# EAGLE schematic usb-fpga-1.20 (EAGLE 4.15)

## Sheet 1 of 8
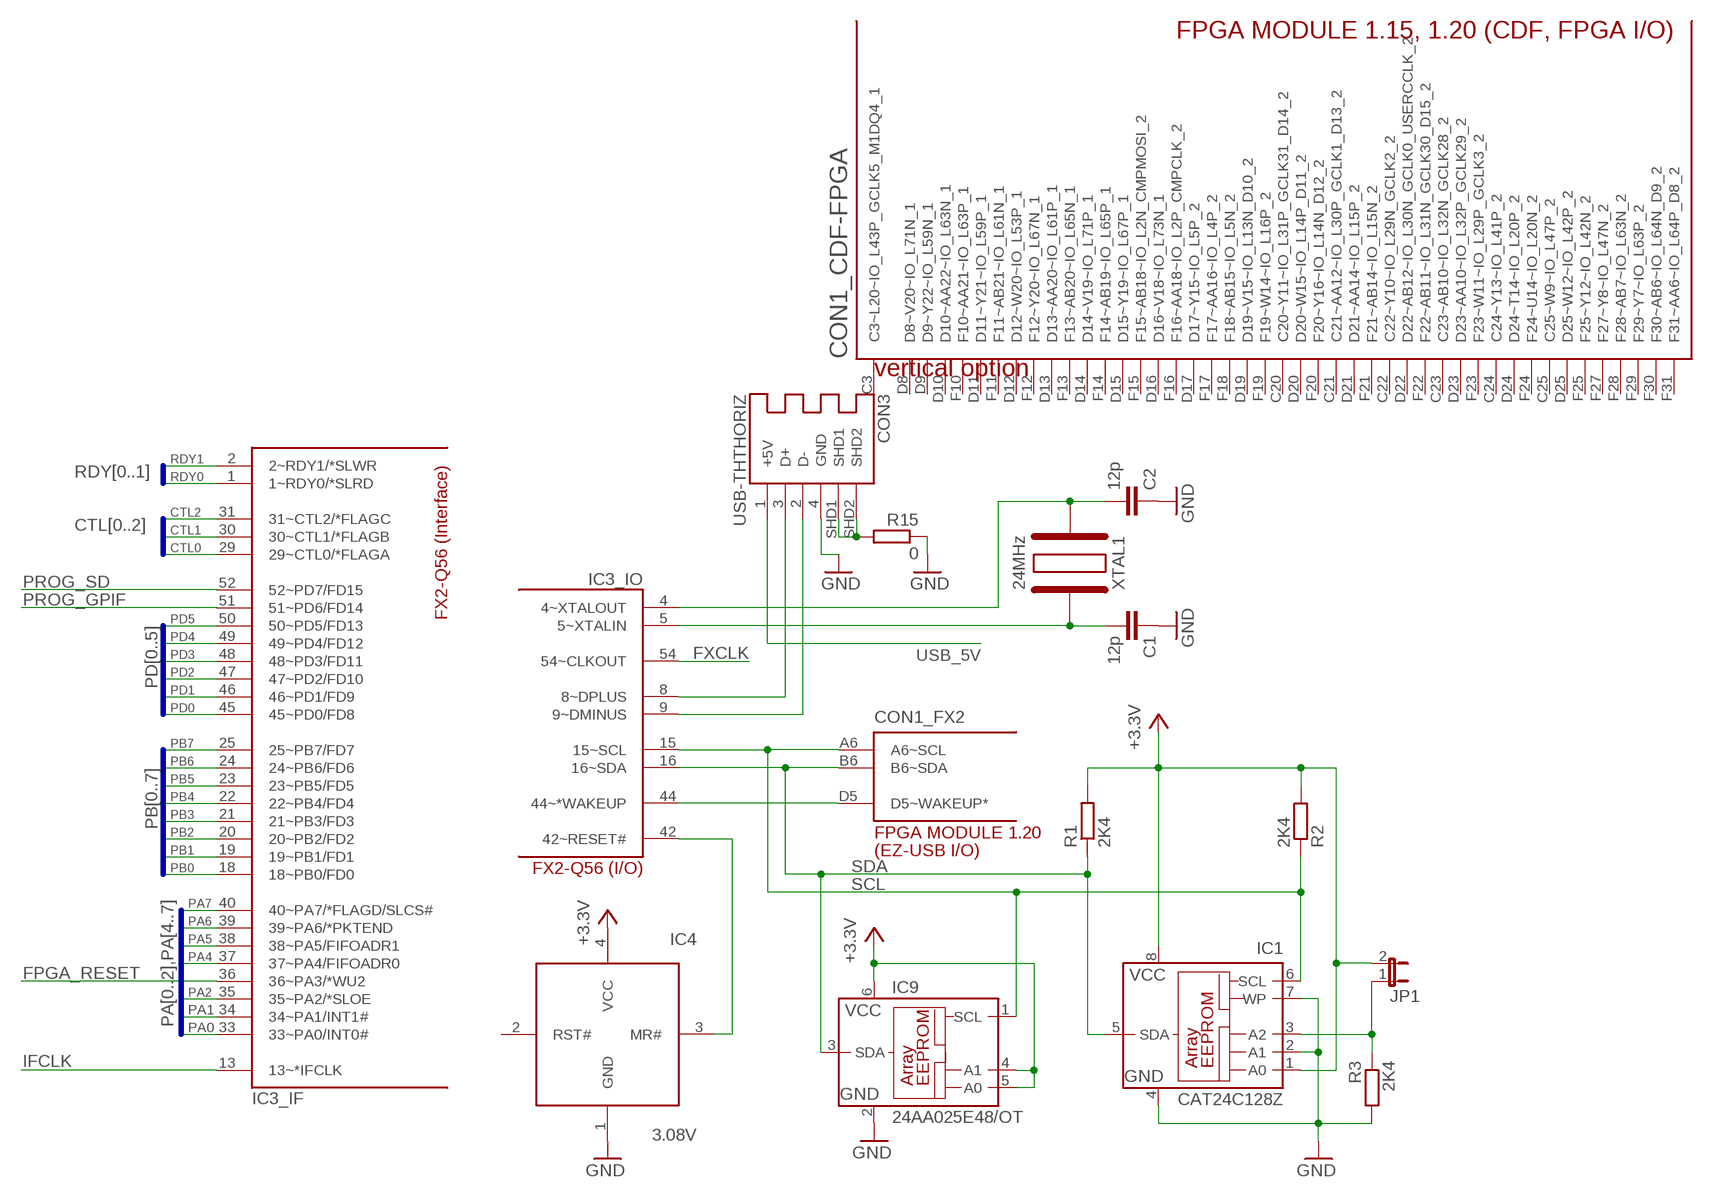
[diagram p0: schematic, sheet 1]

### Parts
C1  12p  C-EUC0805K  [C0805K]
C2  12p  C-EUC0805K  [C0805K]
CON1  1GBE-USB-FPGA1.20  [USB-FPGA1.15]
CON3  USB-THTHORIZ  [USB-HORIZ]
IC1  CAT24C128Z  [MSOP8]
IC3  FX2-Q56  [QFN-56]
IC4  3.08V  STM811  [SOT143]
IC9  24AA025E48/OT  [SOT23-6]
JP1  JP1E2MM  [JP1R2MM]
R1  2K4  R-EU_R0805K  [R0805K]
R2  2K4  R-EU_R0805K  [R0805K]
R3  2K4  R-EU_R0805K  [R0805K]
R15  0  R-EU_R0805K  [R0805K]
XTAL1  24MHz  CRYSTALHU29  [CRYSTAL-HU29]

### Nets
+3.3V [xpwr]: IC1.1(A0) IC1.8(VCC) IC4.4(VCC) IC9.4(A1) IC9.5(A0) IC9.6(VCC) JP1.2 R1.2 R2.2 ; also sheet 2,6,8
CTL0: IC3.29(_IF:29~CTL0/*FLAGA) ; also sheet 3
CTL1: IC3.30(_IF:30~CTL1/*FLAGB) ; also sheet 3
CTL2: IC3.31(_IF:31~CTL2/*FLAGC) ; also sheet 2,3
FPGA_RESET: IC3.36(_IF:36~PA3/*WU2) ; also sheet 2
FXCLK: IC3.54(_IO:54~CLKOUT) ; also sheet 2,3
GND [xpwr]: C1.1 C2.1 CON3.4(GND) IC1.2(A1) IC1.4(GND) IC1.7(WP) IC4.1(GND) IC9.2(GND) R3.2 R15.1 ; also sheet 2,5,6,8
IFCLK: IC3.13(_IF:13~*IFCLK) ; also sheet 2,3
N$3: CON1.D5(_FX2:D5~WAKEUP*) IC3.44(_IO:44~*WAKEUP)
N$5: IC3.42(_IO:42~RESET#) IC4.3(MR#)
N$6 [xpwr]: CON3.SHD1 CON3.SHD2 R15.2
N$103: IC1.3(A2) JP1.1 R3.1
PA0: IC3.33(_IF:33~PA0/INT0#) ; also sheet 3,6
PA1: IC3.34(_IF:34~PA1/INT1#) ; also sheet 3,6
PA2: IC3.35(_IF:35~PA2/*SLOE) ; also sheet 3
PA4: IC3.37(_IF:37~PA4/FIFOADR0) ; also sheet 2,3
PA5: IC3.38(_IF:38~PA5/FIFOADR1) ; also sheet 3
PA6: IC3.39(_IF:39~PA6/*PKTEND) ; also sheet 3
PA7: IC3.40(_IF:40~PA7/*FLAGD/SLCS#) ; also sheet 3
PB0: IC3.18(_IF:18~PB0/FD0) ; also sheet 2,3
PB1: IC3.19(_IF:19~PB1/FD1) ; also sheet 3
PB2: IC3.20(_IF:20~PB2/FD2) ; also sheet 3
PB3: IC3.21(_IF:21~PB3/FD3) ; also sheet 3
PB4: IC3.22(_IF:22~PB4/FD4) ; also sheet 3
PB5: IC3.23(_IF:23~PB5/FD5) ; also sheet 3
PB6: IC3.24(_IF:24~PB6/FD6) ; also sheet 3
PB7: IC3.25(_IF:25~PB7/FD7) ; also sheet 3
PD0: IC3.45(_IF:45~PD0/FD8) ; also sheet 2,3
PD1: IC3.46(_IF:46~PD1/FD9) ; also sheet 3
PD2: IC3.47(_IF:47~PD2/FD10) ; also sheet 2,3
PD3: IC3.48(_IF:48~PD3/FD11) ; also sheet 3
PD4: IC3.49(_IF:49~PD4/FD12) ; also sheet 3
PD5: IC3.50(_IF:50~PD5/FD13) ; also sheet 3
PROG_GPIF: IC3.51(_IF:51~PD6/FD14) ; also sheet 2
PROG_SD: IC3.52(_IF:52~PD7/FD15) ; also sheet 2
RDY0: IC3.1(_IF:1~RDY0/*SLRD) ; also sheet 3
RDY1: IC3.2(_IF:2~RDY1/*SLWR) ; also sheet 3
SCL: CON1.A6(_FX2:A6~SCL) IC1.6(SCL) IC3.15(_IO:15~SCL) IC9.1(SCL) R2.1 ; also sheet 3
SDA: CON1.B6(_FX2:B6~SDA) IC1.5(SDA) IC3.16(_IO:16~SDA) IC9.3(SDA) R1.1 ; also sheet 3
USB_5V [pwr]: CON3.1(+5V) ; also sheet 8
USBD+: CON3.3(D+) IC3.8(_IO:8~DPLUS)
USBD-: CON3.2(D-) IC3.9(_IO:9~DMINUS)
XTAL1A: C2.2 IC3.4(_IO:4~XTALOUT) XTAL1.P$2
XTAL1B: C1.2 IC3.5(_IO:5~XTALIN) XTAL1.P$1
Unconnected: CON1.C7(_COMPAT:C7~VCCO_TOP) CON1.C27(_COMPAT:C27~VCCO_TOP) CON1.C30(_COMPAT:C30~M0) CON1.C31(_COMPAT:C31~M1) CON1.D7(_COMPAT:D7~VCCO_TOP) CON1.D27(_COMPAT:D27~VCCO_TOP) IC4.2(RST#)

### Buses
PA[0..2],PA[4..7]
PD[0..5]
PB[0..7]
CTL[0..2]
RDY[0..1]

### Notes on the sheet
- vertical option

## Sheet 2 of 8
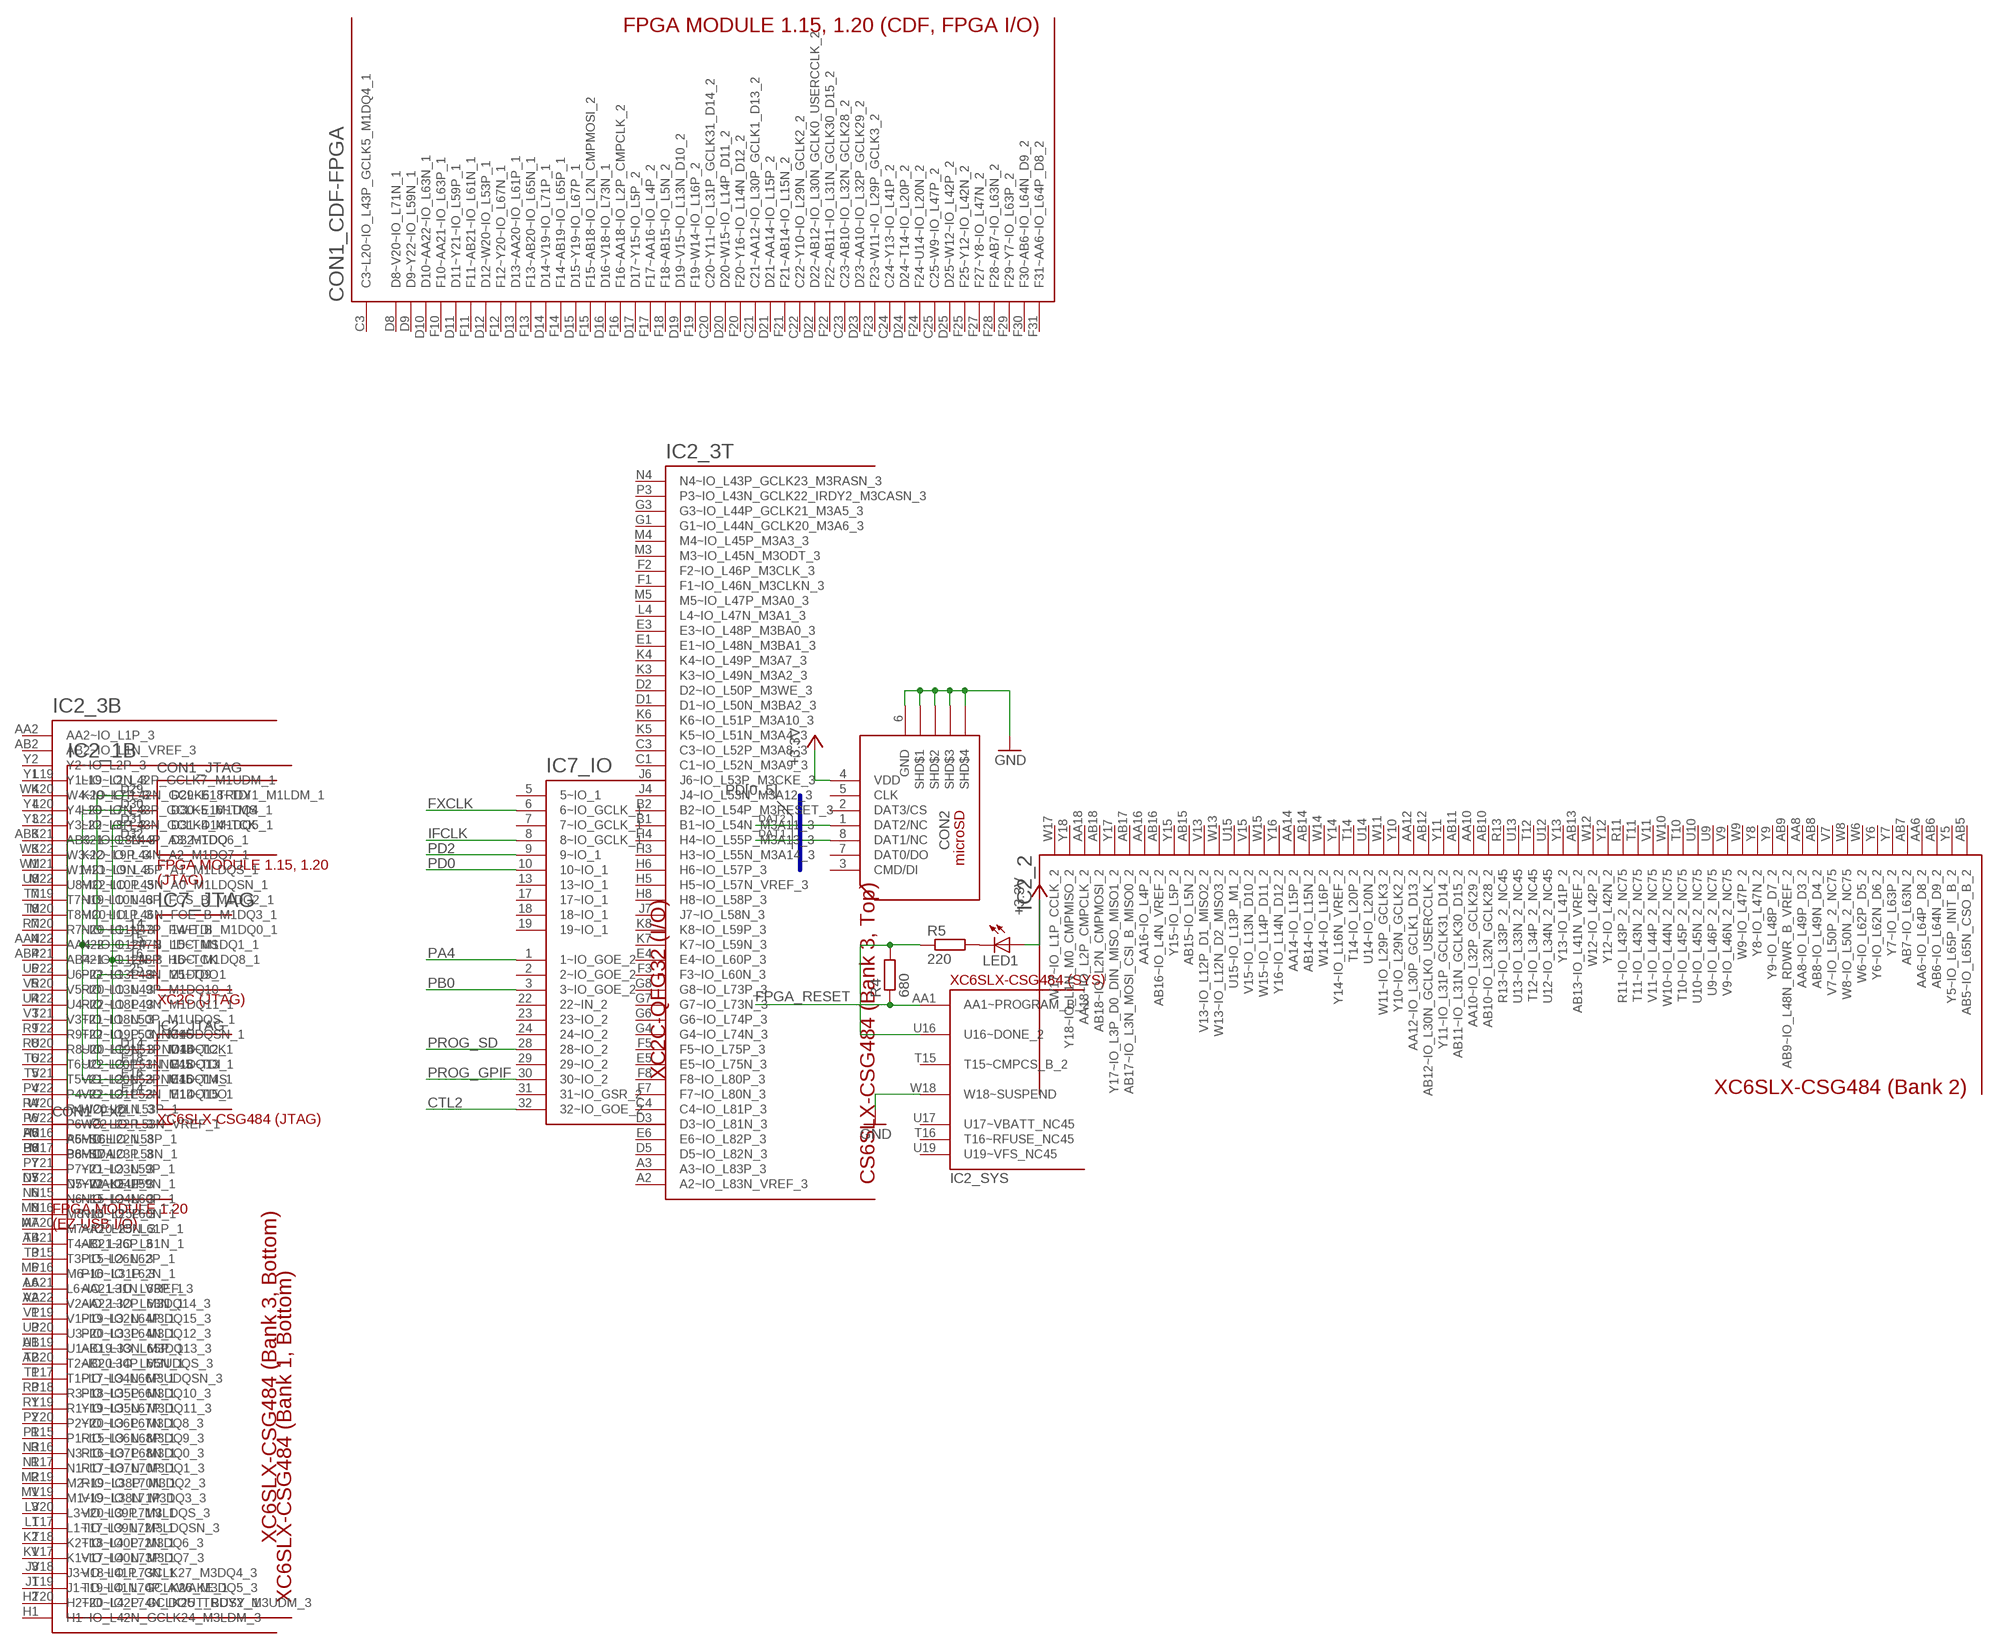
[diagram p1: schematic, sheet 2]

### Parts
CON2  MICROSDMC  [MICROSD-MULTICOMP]
IC2  XC6SLX-CSG484CSG484  [CSG484]
IC7  XC2C-QFG32QFG32  [QFG32]
LED1  LED1206-A_MARK  [LED1206-A_MARK]
R4  680  R-EU_R0805K  [R0805K]
R5  220  R-EU_R0805K  [R0805K]

### Nets
+3.3V [xpwr]: CON2.4(VDD) LED1.A ; also sheet 1,6,8
CTL2: IC7.32(_IO:32~IO_GOE_2) ; also sheet 1,3
DAT1: CON2.8(DAT1/NC) ; also sheet 3
DAT2: CON2.1(DAT2/NC) ; also sheet 3
FPGA_RESET: IC2.AA1(_SYS:AA1~PROGRAM_B_2) R4.1 ; also sheet 1
FXCLK: IC7.6(_IO:6~IO_GCLK_1) ; also sheet 1,3
GND [xpwr]: CON2.6(GND) CON2.CD1(SHD$1) CON2.CD2(SHD$2) CON2.SGD2(SHD$3) CON2.SHD1(SHD$4) IC2.W18(_SYS:W18~SUSPEND) ; also sheet 1,5,6,8
IFCLK: IC7.8(_IO:8~IO_GCLK_1) ; also sheet 1,3
N$1: IC2.U16(_SYS:U16~DONE_2) R4.2 R5.1
N$4: LED1.C R5.2
PA4: IC7.1(_IO:1~IO_GOE_2) ; also sheet 1,3
PB0: IC7.3(_IO:3~IO_GOE_2) ; also sheet 1,3
PD0: IC7.10(_IO:10~IO_1) ; also sheet 1,3
PD2: IC7.9(_IO:9~IO_1) ; also sheet 1,3
PROG_GPIF: IC7.30(_IO:30~IO_2) ; also sheet 1
PROG_SD: IC7.28(_IO:28~IO_2) ; also sheet 1
TCK: CON1.D31(_JTAG:D31~D14~TCK) IC2.D14(_JTAG:D14~TCK) IC7.16(_JTAG:16~TCK)
TDI: CON1.D29(_JTAG:D29~E18~TDI) IC7.14(_JTAG:14~TDI)
TDIO: IC2.E18(_JTAG:E18~TDI) IC7.25(_JTAG:25~TDO)
TDO: CON1.D32(_JTAG:D32~TDO) IC2.E14(_JTAG:E14~TDO)
TMS: CON1.D30(_JTAG:D30~E16~TMS) IC2.E16(_JTAG:E16~TMS) IC7.15(_JTAG:15~TMS)
Unconnected: CON2.2(DAT3/CS) CON2.3(CMD/DI) CON2.5(CLK) CON2.7(DAT0/DO) IC2.T15(_SYS:T15~CMPCS_B_2) IC2.T16(_SYS:T16~RFUSE_NC45) IC2.U17(_SYS:U17~VBATT_NC45) IC2.U19(_SYS:U19~VFS_NC45) IC7.2(_IO:2~IO_GOE_2) IC7.5(_IO:5~IO_1) IC7.7(_IO:7~IO_GCLK_1) IC7.13(_IO:13~IO_1) IC7.17(_IO:17~IO_1) IC7.18(_IO:18~IO_1) IC7.19(_IO:19~IO_1) IC7.22(_IO:22~IN_2) IC7.23(_IO:23~IO_2) IC7.24(_IO:24~IO_2) IC7.29(_IO:29~IO_2) IC7.31(_IO:31~IO_GSR_2)

### Buses
PD[0..5]

## Sheet 3 of 8
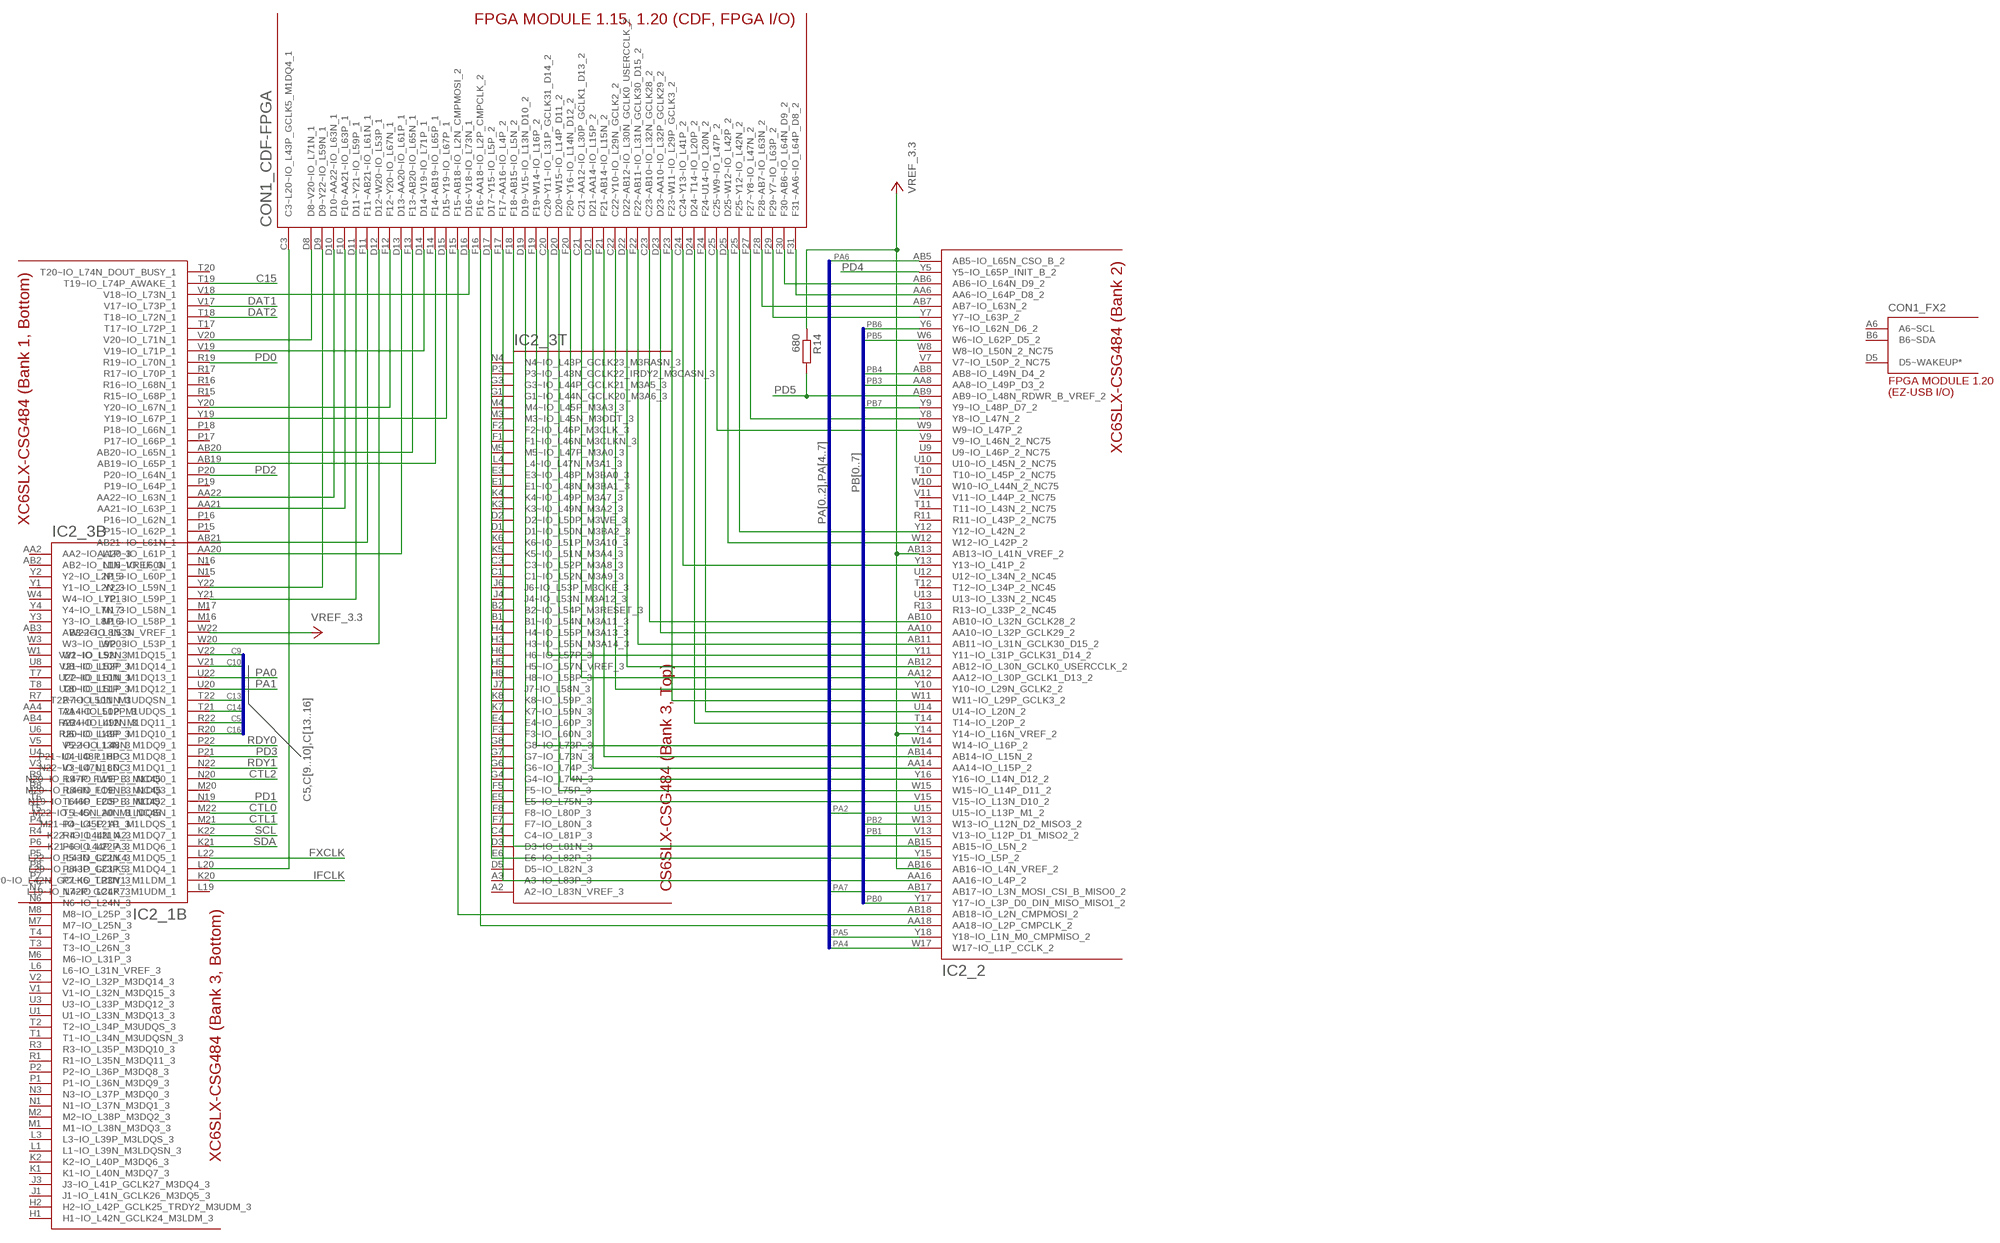
[diagram p2: schematic, sheet 3]

### Parts
R14  680  R-EU_R0805K  [R0805K]

### Nets
C3: CON1.C3(_CDF-FPGA:C3~L20~IO_L43P_GCLK5_M1DQ4_1) IC2.L20(_1B:L20~IO_L43P_GCLK5_M1DQ4_1)
C5: IC2.R22(_1B:R22~IO_L49N_M1DQ11_1) ; also sheet 6
C9: IC2.V22(_1B:V22~IO_L52N_M1DQ15_1) ; also sheet 6
C10: IC2.V21(_1B:V21~IO_L52P_M1DQ14_1) ; also sheet 6
C13: IC2.T22(_1B:T22~IO_L50N_M1UDQSN_1) ; also sheet 6
C14: IC2.T21(_1B:T21~IO_L50P_M1UDQS_1) ; also sheet 6
C15: IC2.T19(_1B:T19~IO_L74P_AWAKE_1) ; also sheet 6
C16: IC2.R20(_1B:R20~IO_L49P_M1DQ10_1) ; also sheet 6
C20: CON1.C20(_CDF-FPGA:C20~Y11~IO_L31P_GCLK31_D14_2) IC2.Y11(_2:Y11~IO_L31P_GCLK31_D14_2)
C21: CON1.C21(_CDF-FPGA:C21~AA12~IO_L30P_GCLK1_D13_2) IC2.AA12(_2:AA12~IO_L30P_GCLK1_D13_2)
C22: CON1.C22(_CDF-FPGA:C22~Y10~IO_L29N_GCLK2_2) IC2.Y10(_2:Y10~IO_L29N_GCLK2_2)
C23: CON1.C23(_CDF-FPGA:C23~AB10~IO_L32N_GCLK28_2) IC2.AB10(_2:AB10~IO_L32N_GCLK28_2)
C24: CON1.C24(_CDF-FPGA:C24~Y13~IO_L41P_2) IC2.Y13(_2:Y13~IO_L41P_2)
C25: CON1.C25(_CDF-FPGA:C25~W9~IO_L47P_2) IC2.W9(_2:W9~IO_L47P_2)
CTL0: IC2.M22(_1B:M22~IO_L45N_A0_M1LDQSN_1) ; also sheet 1
CTL1: IC2.M21(_1B:M21~IO_L45P_A1_M1LDQS_1) ; also sheet 1
CTL2: IC2.N20(_1B:N20~IO_L47P_FWE_B_M1DQ0_1) ; also sheet 1,2
D8: CON1.D8(_CDF-FPGA:D8~V20~IO_L71N_1) IC2.V20(_1B:V20~IO_L71N_1)
D9: CON1.D9(_CDF-FPGA:D9~Y22~IO_L59N_1) IC2.Y22(_1B:Y22~IO_L59N_1)
D10: CON1.D10(_CDF-FPGA:D10~AA22~IO_L63N_1) IC2.AA22(_1B:AA22~IO_L63N_1)
D11: CON1.D11(_CDF-FPGA:D11~Y21~IO_L59P_1) IC2.Y21(_1B:Y21~IO_L59P_1)
D12: CON1.D12(_CDF-FPGA:D12~W20~IO_L53P_1) IC2.W20(_1B:W20~IO_L53P_1)
D13: CON1.D13(_CDF-FPGA:D13~AA20~IO_L61P_1) IC2.AA20(_1B:AA20~IO_L61P_1)
D14: CON1.D14(_CDF-FPGA:D14~V19~IO_L71P_1) IC2.V19(_1B:V19~IO_L71P_1)
D15: CON1.D15(_CDF-FPGA:D15~Y19~IO_L67P_1) IC2.Y19(_1B:Y19~IO_L67P_1)
D16: CON1.D16(_CDF-FPGA:D16~V18~IO_L73N_1) IC2.V18(_1B:V18~IO_L73N_1)
D17: CON1.D17(_CDF-FPGA:D17~Y15~IO_L5P_2) IC2.Y15(_2:Y15~IO_L5P_2)
D19: CON1.D19(_CDF-FPGA:D19~V15~IO_L13N_D10_2) IC2.V15(_2:V15~IO_L13N_D10_2)
D20: CON1.D20(_CDF-FPGA:D20~W15~IO_L14P_D11_2) IC2.W15(_2:W15~IO_L14P_D11_2)
D21: CON1.D21(_CDF-FPGA:D21~AA14~IO_L15P_2) IC2.AA14(_2:AA14~IO_L15P_2)
D22: CON1.D22(_CDF-FPGA:D22~AB12~IO_L30N_GCLK0_USERCCLK_2) IC2.AB12(_2:AB12~IO_L30N_GCLK0_USERCCLK_2)
D23: CON1.D23(_CDF-FPGA:D23~AA10~IO_L32P_GCLK29_2) IC2.AA10(_2:AA10~IO_L32P_GCLK29_2)
D24: CON1.D24(_CDF-FPGA:D24~T14~IO_L20P_2) IC2.T14(_2:T14~IO_L20P_2)
D25: CON1.D25(_CDF-FPGA:D25~W12~IO_L42P_2) IC2.W12(_2:W12~IO_L42P_2)
DAT1: IC2.V17(_1B:V17~IO_L73P_1) ; also sheet 2
DAT2: IC2.T18(_1B:T18~IO_L72N_1) ; also sheet 2
F10: CON1.F10(_CDF-FPGA:F10~AA21~IO_L63P_1) IC2.AA21(_1B:AA21~IO_L63P_1)
F11: CON1.F11(_CDF-FPGA:F11~AB21~IO_L61N_1) IC2.AB21(_1B:AB21~IO_L61N_1)
F12: CON1.F12(_CDF-FPGA:F12~Y20~IO_L67N_1) IC2.Y20(_1B:Y20~IO_L67N_1)
F13: CON1.F13(_CDF-FPGA:F13~AB20~IO_L65N_1) IC2.AB20(_1B:AB20~IO_L65N_1)
F14: CON1.F14(_CDF-FPGA:F14~AB19~IO_L65P_1) IC2.AB19(_1B:AB19~IO_L65P_1)
F15: CON1.F15(_CDF-FPGA:F15~AB18~IO_L2N_CMPMOSI_2) IC2.AB18(_2:AB18~IO_L2N_CMPMOSI_2)
F16: CON1.F16(_CDF-FPGA:F16~AA18~IO_L2P_CMPCLK_2) IC2.AA18(_2:AA18~IO_L2P_CMPCLK_2)
F17: CON1.F17(_CDF-FPGA:F17~AA16~IO_L4P_2) IC2.AA16(_2:AA16~IO_L4P_2)
F18: CON1.F18(_CDF-FPGA:F18~AB15~IO_L5N_2) IC2.AB15(_2:AB15~IO_L5N_2)
F19: CON1.F19(_CDF-FPGA:F19~W14~IO_L16P_2) IC2.W14(_2:W14~IO_L16P_2)
F20: CON1.F20(_CDF-FPGA:F20~Y16~IO_L14N_D12_2) IC2.Y16(_2:Y16~IO_L14N_D12_2)
F21: CON1.F21(_CDF-FPGA:F21~AB14~IO_L15N_2) IC2.AB14(_2:AB14~IO_L15N_2)
F22: CON1.F22(_CDF-FPGA:F22~AB11~IO_L31N_GCLK30_D15_2) IC2.AB11(_2:AB11~IO_L31N_GCLK30_D15_2)
F23: CON1.F23(_CDF-FPGA:F23~W11~IO_L29P_GCLK3_2) IC2.W11(_2:W11~IO_L29P_GCLK3_2)
F24: CON1.F24(_CDF-FPGA:F24~U14~IO_L20N_2) IC2.U14(_2:U14~IO_L20N_2)
F25: CON1.F25(_CDF-FPGA:F25~Y12~IO_L42N_2) IC2.Y12(_2:Y12~IO_L42N_2)
F27: CON1.F27(_CDF-FPGA:F27~Y8~IO_L47N_2) IC2.Y8(_2:Y8~IO_L47N_2)
F28: CON1.F28(_CDF-FPGA:F28~AB7~IO_L63N_2) IC2.AB7(_2:AB7~IO_L63N_2)
F29: CON1.F29(_CDF-FPGA:F29~Y7~IO_L63P_2) IC2.Y7(_2:Y7~IO_L63P_2)
F30: CON1.F30(_CDF-FPGA:F30~AB6~IO_L64N_D9_2) IC2.AB6(_2:AB6~IO_L64N_D9_2)
F31: CON1.F31(_CDF-FPGA:F31~AA6~IO_L64P_D8_2) IC2.AA6(_2:AA6~IO_L64P_D8_2)
FXCLK: IC2.L22(_1B:L22~IO_L43N_GCLK4_M1DQ5_1) ; also sheet 1,2
IFCLK: IC2.K20(_1B:K20~IO_L42N_GCLK6_TRDY1_M1LDM_1) ; also sheet 1,2
PA0: IC2.U22(_1B:U22~IO_L51N_M1DQ13_1) ; also sheet 1,6
PA1: IC2.U20(_1B:U20~IO_L51P_M1DQ12_1) ; also sheet 1,6
PA2: IC2.U15(_2:U15~IO_L13P_M1_2) ; also sheet 1
PA4: IC2.W17(_2:W17~IO_L1P_CCLK_2) ; also sheet 1,2
PA5: IC2.Y18(_2:Y18~IO_L1N_M0_CMPMISO_2) ; also sheet 1
PA6: IC2.AB5(_2:AB5~IO_L65N_CSO_B_2) ; also sheet 1
PA7: IC2.AB17(_2:AB17~IO_L3N_MOSI_CSI_B_MISO0_2) ; also sheet 1
PB0: IC2.Y17(_2:Y17~IO_L3P_D0_DIN_MISO_MISO1_2) ; also sheet 1,2
PB1: IC2.V13(_2:V13~IO_L12P_D1_MISO2_2) ; also sheet 1
PB2: IC2.W13(_2:W13~IO_L12N_D2_MISO3_2) ; also sheet 1
PB3: IC2.AA8(_2:AA8~IO_L49P_D3_2) ; also sheet 1
PB4: IC2.AB8(_2:AB8~IO_L49N_D4_2) ; also sheet 1
PB5: IC2.W6(_2:W6~IO_L62P_D5_2) ; also sheet 1
PB6: IC2.Y6(_2:Y6~IO_L62N_D6_2) ; also sheet 1
PB7: IC2.Y9(_2:Y9~IO_L48P_D7_2) ; also sheet 1
PD0: IC2.R19(_1B:R19~IO_L70N_1) ; also sheet 1,2
PD1: IC2.N19(_1B:N19~IO_L46P_FCS_B_M1DQ2_1) ; also sheet 1
PD2: IC2.P20(_1B:P20~IO_L64N_1) ; also sheet 1,2
PD3: IC2.P21(_1B:P21~IO_L48P_HDC_M1DQ8_1) ; also sheet 1
PD4: IC2.Y5(_2:Y5~IO_L65P_INIT_B_2) ; also sheet 1
PD5: IC2.AB9(_2:AB9~IO_L48N_RDWR_B_VREF_2) R14.2 ; also sheet 1
RDY0: IC2.P22(_1B:P22~IO_L48N_M1DQ9_1) ; also sheet 1
RDY1: IC2.N22(_1B:N22~IO_L47N_LDC_M1DQ1_1) ; also sheet 1
SCL: IC2.K22(_1B:K22~IO_L44N_A2_M1DQ7_1) ; also sheet 1
SDA: IC2.K21(_1B:K21~IO_L44P_A3_M1DQ6_1) ; also sheet 1
VREF_3.3 [vref]: IC2.AB13(_2:AB13~IO_L41N_VREF_2) IC2.AB16(_2:AB16~IO_L4N_VREF_2) IC2.W22(_1B:W22~IO_L53N_VREF_1) IC2.Y14(_2:Y14~IO_L16N_VREF_2) R14.1 ; also sheet 6,8

### Buses
PB[0..7]
PA[0..2],PA[4..7]
C5,C[9..10],C[13..16]

## Sheet 4 of 8
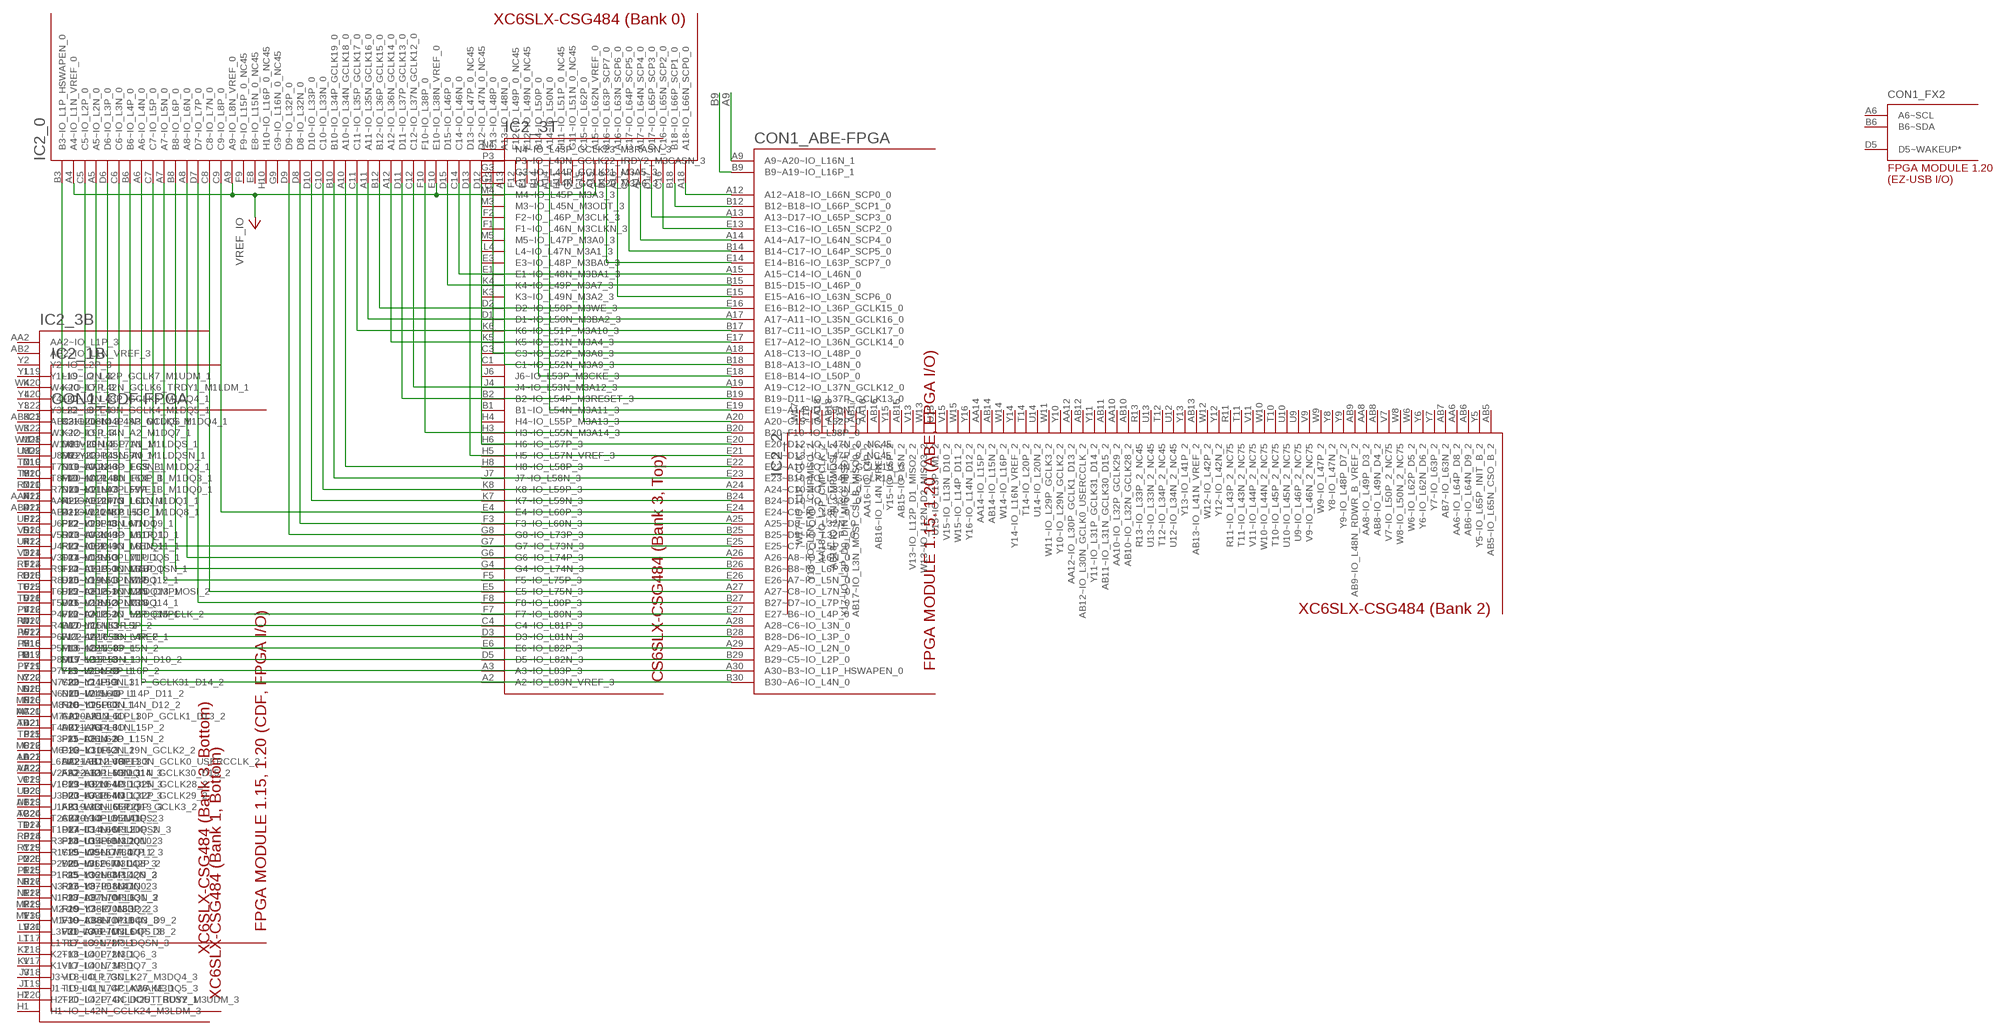
[diagram p3: schematic, sheet 4]

### Nets
A9: CON1.A9(_ABE-FPGA:A9~A20~IO_L16N_1) ; also sheet 6
A12: CON1.A12(_ABE-FPGA:A12~A18~IO_L66N_SCP0_0) IC2.A18(_0:A18~IO_L66N_SCP0_0)
A13: CON1.A13(_ABE-FPGA:A13~D17~IO_L65P_SCP3_0) IC2.D17(_0:D17~IO_L65P_SCP3_0)
A14: CON1.A14(_ABE-FPGA:A14~A17~IO_L64N_SCP4_0) IC2.A17(_0:A17~IO_L64N_SCP4_0)
A15: CON1.A15(_ABE-FPGA:A15~C14~IO_L46N_0) IC2.C14(_0:C14~IO_L46N_0)
A17: CON1.A17(_ABE-FPGA:A17~A11~IO_L35N_GCLK16_0) IC2.A11(_0:A11~IO_L35N_GCLK16_0)
A18: CON1.A18(_ABE-FPGA:A18~C13~IO_L48P_0) IC2.C13(_0:C13~IO_L48P_0)
A19: CON1.A19(_ABE-FPGA:A19~C12~IO_L37N_GCLK12_0) IC2.C12(_0:C12~IO_L37N_GCLK12_0)
A20: CON1.A20(_ABE-FPGA:A20~C15~IO_L62P_0) IC2.C15(_0:C15~IO_L62P_0)
A24: CON1.A24(_ABE-FPGA:A24~C10~IO_L33N_0) IC2.C10(_0:C10~IO_L33N_0)
A25: CON1.A25(_ABE-FPGA:A25~D8~IO_L32N_0) IC2.D8(_0:D8~IO_L32N_0)
A26: CON1.A26(_ABE-FPGA:A26~A8~IO_L6N_0) IC2.A8(_0:A8~IO_L6N_0)
A27: CON1.A27(_ABE-FPGA:A27~C8~IO_L7N_0) IC2.C8(_0:C8~IO_L7N_0)
A28: CON1.A28(_ABE-FPGA:A28~C6~IO_L3N_0) IC2.C6(_0:C6~IO_L3N_0)
A29: CON1.A29(_ABE-FPGA:A29~A5~IO_L2N_0) IC2.A5(_0:A5~IO_L2N_0)
A30: CON1.A30(_ABE-FPGA:A30~B3~IO_L1P_HSWAPEN_0) IC2.B3(_0:B3~IO_L1P_HSWAPEN_0)
B9: CON1.B9(_ABE-FPGA:B9~A19~IO_L16P_1) ; also sheet 6
B12: CON1.B12(_ABE-FPGA:B12~B18~IO_L66P_SCP1_0) IC2.B18(_0:B18~IO_L66P_SCP1_0)
B14: CON1.B14(_ABE-FPGA:B14~C17~IO_L64P_SCP5_0) IC2.C17(_0:C17~IO_L64P_SCP5_0)
B15: CON1.B15(_ABE-FPGA:B15~D15~IO_L46P_0) IC2.D15(_0:D15~IO_L46P_0)
B17: CON1.B17(_ABE-FPGA:B17~C11~IO_L35P_GCLK17_0) IC2.C11(_0:C11~IO_L35P_GCLK17_0)
B18: CON1.B18(_ABE-FPGA:B18~A13~IO_L48N_0) IC2.A13(_0:A13~IO_L48N_0)
B19: CON1.B19(_ABE-FPGA:B19~D11~IO_L37P_GCLK13_0) IC2.D11(_0:D11~IO_L37P_GCLK13_0)
B20: CON1.B20(_ABE-FPGA:B20~F10~IO_L38P_0) IC2.F10(_0:F10~IO_L38P_0)
B24: CON1.B24(_ABE-FPGA:B24~D10~IO_L33P_0) IC2.D10(_0:D10~IO_L33P_0)
B25: CON1.B25(_ABE-FPGA:B25~D9~IO_L32P_0) IC2.D9(_0:D9~IO_L32P_0)
B26: CON1.B26(_ABE-FPGA:B26~B8~IO_L6P_0) IC2.B8(_0:B8~IO_L6P_0)
B27: CON1.B27(_ABE-FPGA:B27~D7~IO_L7P_0) IC2.D7(_0:D7~IO_L7P_0)
B28: CON1.B28(_ABE-FPGA:B28~D6~IO_L3P_0) IC2.D6(_0:D6~IO_L3P_0)
B29: CON1.B29(_ABE-FPGA:B29~C5~IO_L2P_0) IC2.C5(_0:C5~IO_L2P_0)
B30: CON1.B30(_ABE-FPGA:B30~A6~IO_L4N_0) IC2.A6(_0:A6~IO_L4N_0)
E13: CON1.E13(_ABE-FPGA:E13~C16~IO_L65N_SCP2_0) IC2.C16(_0:C16~IO_L65N_SCP2_0)
E14: CON1.E14(_ABE-FPGA:E14~B16~IO_L63P_SCP7_0) IC2.B16(_0:B16~IO_L63P_SCP7_0)
E15: CON1.E15(_ABE-FPGA:E15~A16~IO_L63N_SCP6_0) IC2.A16(_0:A16~IO_L63N_SCP6_0)
E16: CON1.E16(_ABE-FPGA:E16~B12~IO_L36P_GCLK15_0) IC2.B12(_0:B12~IO_L36P_GCLK15_0)
E17: CON1.E17(_ABE-FPGA:E17~A12~IO_L36N_GCLK14_0) IC2.A12(_0:A12~IO_L36N_GCLK14_0)
E18: CON1.E18(_ABE-FPGA:E18~B14~IO_L50P_0) IC2.B14(_0:B14~IO_L50P_0)
E19: CON1.E19(_ABE-FPGA:E19~A14~IO_L50N_0) IC2.A14(_0:A14~IO_L50N_0)
E20: CON1.E20(_ABE-FPGA:E20~D12~IO_L47N_0_NC45) IC2.D12(_0:D12~IO_L47N_0_NC45)
E21: CON1.E21(_ABE-FPGA:E21~D13~IO_L47P_0_NC45) IC2.D13(_0:D13~IO_L47P_0_NC45)
E22: CON1.E22(_ABE-FPGA:E22~A10~IO_L34N_GCLK18_0) IC2.A10(_0:A10~IO_L34N_GCLK18_0)
E23: CON1.E23(_ABE-FPGA:E23~B10~IO_L34P_GCLK19_0) IC2.B10(_0:B10~IO_L34P_GCLK19_0)
E24: CON1.E24(_ABE-FPGA:E24~C9~IO_L8P_0) IC2.C9(_0:C9~IO_L8P_0)
E25: CON1.E25(_ABE-FPGA:E25~C7~IO_L5P_0) IC2.C7(_0:C7~IO_L5P_0)
E26: CON1.E26(_ABE-FPGA:E26~A7~IO_L5N_0) IC2.A7(_0:A7~IO_L5N_0)
E27: CON1.E27(_ABE-FPGA:E27~B6~IO_L4P_0) IC2.B6(_0:B6~IO_L4P_0)
VREF_IO [vref]: IC2.A4(_0:A4~IO_L1N_VREF_0) IC2.A9(_0:A9~IO_L8N_VREF_0) IC2.A15(_0:A15~IO_L62N_VREF_0) IC2.E10(_0:E10~IO_L38N_VREF_0) ; also sheet 8
Unconnected: IC2.E8(_0:E8~IO_L15N_0_NC45) IC2.E12(_0:E12~IO_L49N_0_NC45) IC2.F9(_0:F9~IO_L15P_0_NC45) IC2.F12(_0:F12~IO_L49P_0_NC45) IC2.G9(_0:G9~IO_L16N_0_NC45) IC2.G11(_0:G11~IO_L51N_0_NC45) IC2.H10(_0:H10~IO_L16P_0_NC45) IC2.H11(_0:H11~IO_L51P_0_NC45)

## Sheet 5 of 8
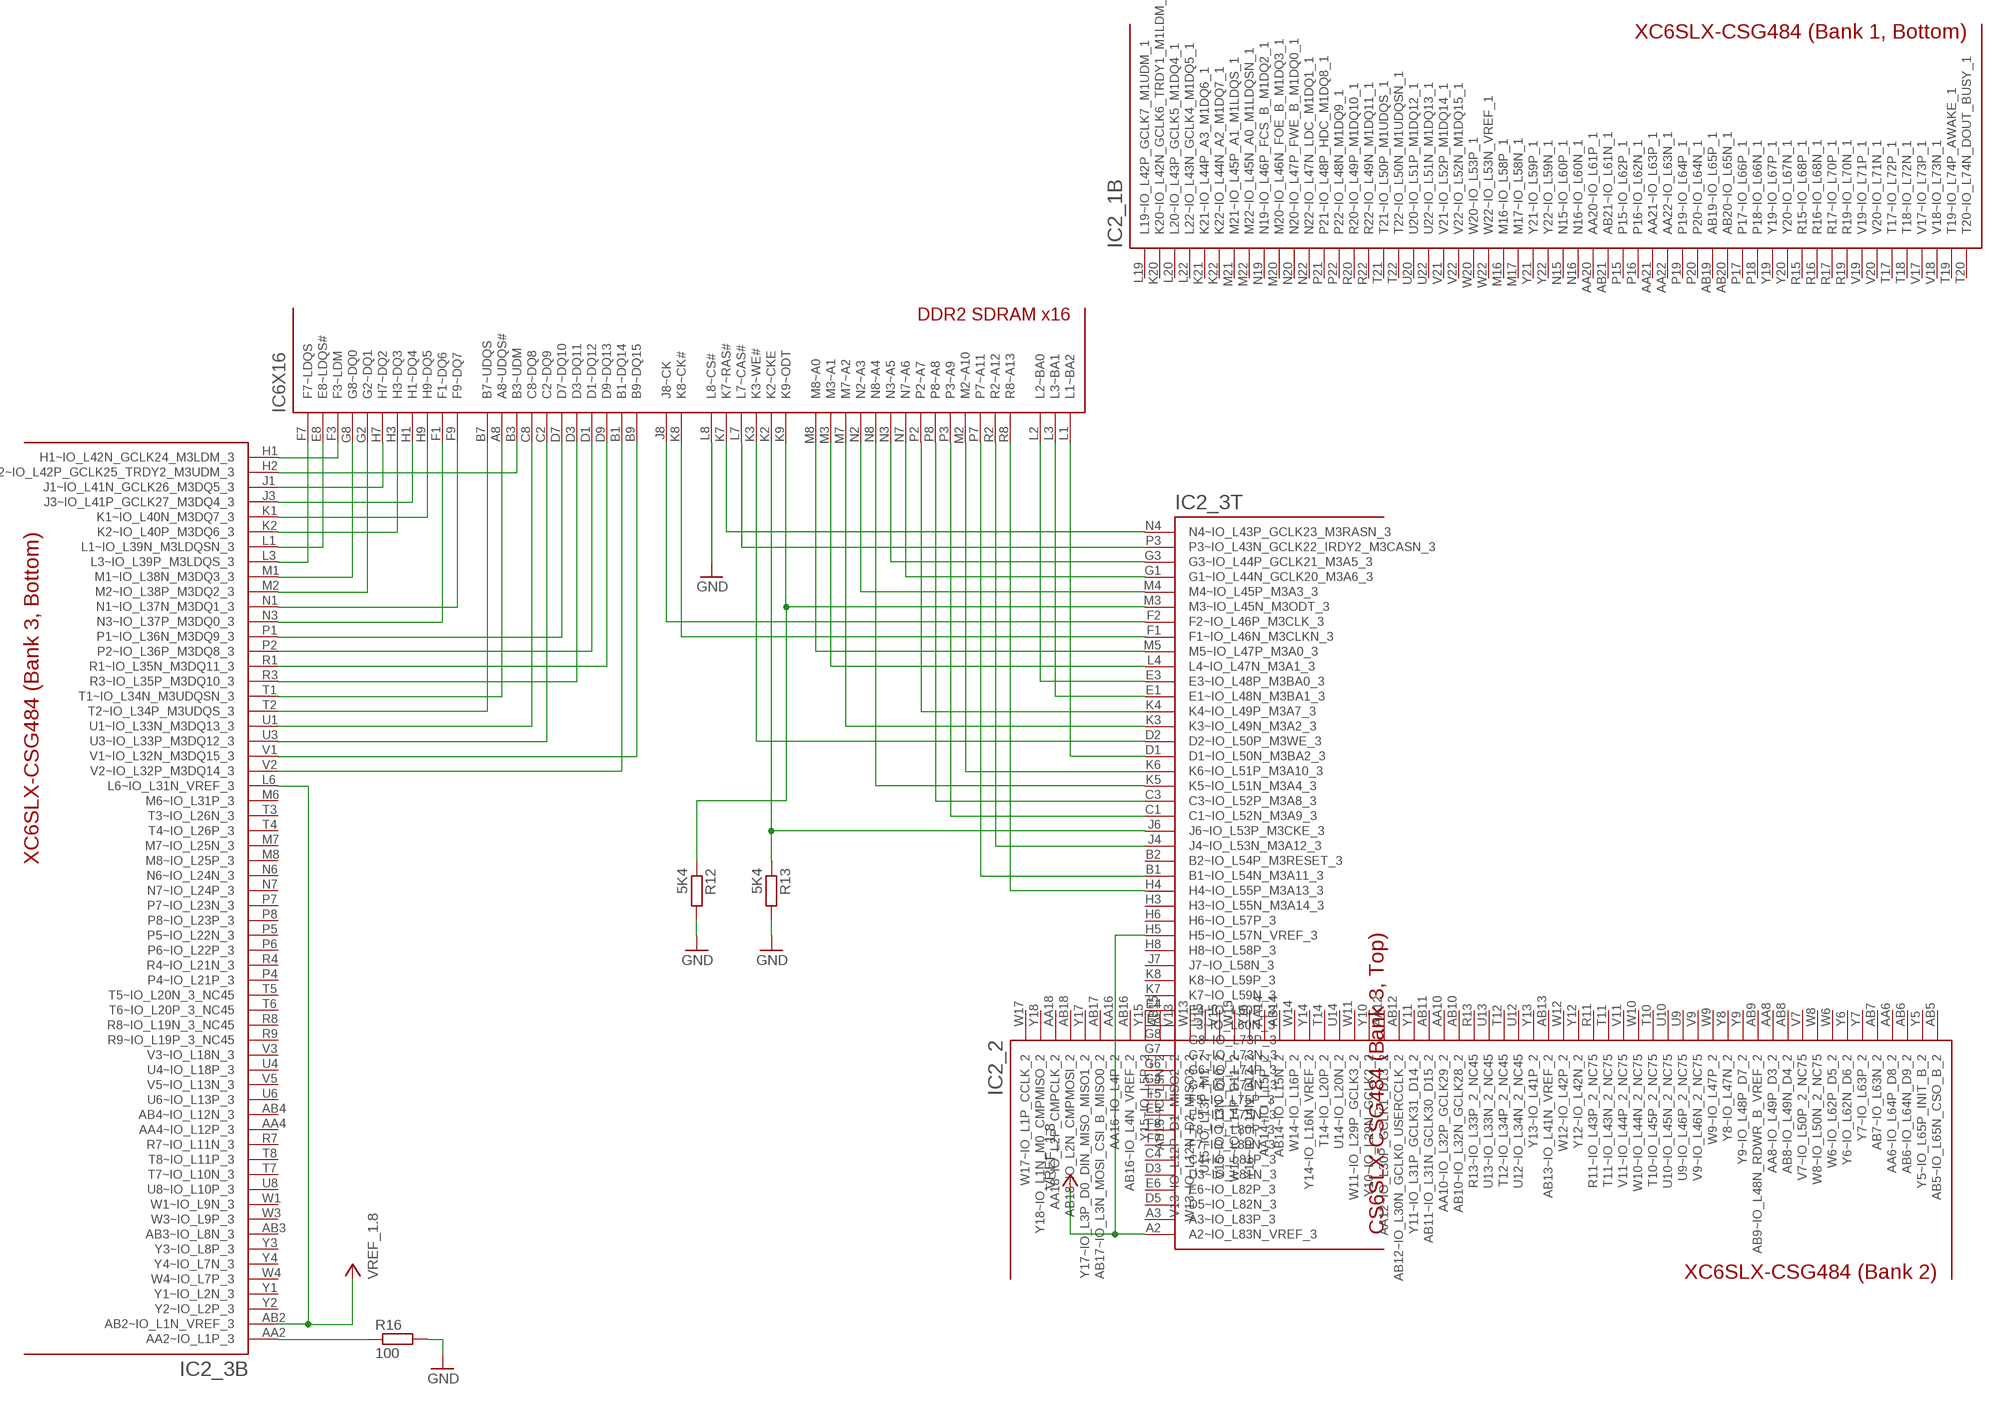
[diagram p4: schematic, sheet 5]

### Parts
IC6  DDR2_SDRAM-X16FBGA84  [FBGA84]
R12  5K4  R-EU_R0805K  [R0805K]
R13  5K4  R-EU_R0805K  [R0805K]
R16  100  R-EU_R0805K  [R0805K]

### Nets
GND [xpwr]: IC6.L8(X16:L8~CS#) R12.2 R13.2 R16.2 ; also sheet 1,2,6,8
MA0 [ddr]: IC2.M5(_3T:M5~IO_L47P_M3A0_3) IC6.M8(X16:M8~A0)
MA1 [ddr]: IC2.L4(_3T:L4~IO_L47N_M3A1_3) IC6.M3(X16:M3~A1)
MA2 [ddr]: IC2.K3(_3T:K3~IO_L49N_M3A2_3) IC6.M7(X16:M7~A2)
MA3 [ddr]: IC2.M4(_3T:M4~IO_L45P_M3A3_3) IC6.N2(X16:N2~A3)
MA4 [ddr]: IC2.K5(_3T:K5~IO_L51N_M3A4_3) IC6.N8(X16:N8~A4)
MA5 [ddr]: IC2.G3(_3T:G3~IO_L44P_GCLK21_M3A5_3) IC6.N3(X16:N3~A5)
MA6 [ddr]: IC2.G1(_3T:G1~IO_L44N_GCLK20_M3A6_3) IC6.N7(X16:N7~A6)
MA7 [ddr]: IC2.K4(_3T:K4~IO_L49P_M3A7_3) IC6.P2(X16:P2~A7)
MA8 [ddr]: IC2.C3(_3T:C3~IO_L52P_M3A8_3) IC6.P8(X16:P8~A8)
MA9 [ddr]: IC2.C1(_3T:C1~IO_L52N_M3A9_3) IC6.P3(X16:P3~A9)
MA10 [ddr]: IC2.K6(_3T:K6~IO_L51P_M3A10_3) IC6.M2(X16:M2~A10)
MA11 [ddr]: IC2.B1(_3T:B1~IO_L54N_M3A11_3) IC6.P7(X16:P7~A11)
MA12 [ddr]: IC2.J4(_3T:J4~IO_L53N_M3A12_3) IC6.R2(X16:R2~A12)
MA13 [ddr]: IC2.H4(_3T:H4~IO_L55P_M3A13_3) IC6.R8(X16:R8~A13)
MBA0 [ddr]: IC2.E3(_3T:E3~IO_L48P_M3BA0_3) IC6.L2(X16:L2~BA0)
MBA1 [ddr]: IC2.E1(_3T:E1~IO_L48N_M3BA1_3) IC6.L3(X16:L3~BA1)
MBA2 [ddr]: IC2.D1(_3T:D1~IO_L50N_M3BA2_3) IC6.L1(X16:L1~BA2)
MCCAS# [ddr]: IC2.P3(_3T:P3~IO_L43N_GCLK22_IRDY2_M3CASN_3) IC6.L7(X16:L7~CAS#)
MCCKE [ddr]: IC2.J6(_3T:J6~IO_L53P_M3CKE_3) IC6.K2(X16:K2~CKE) R13.1
MCK [diff]: IC2.F2(_3T:F2~IO_L46P_M3CLK_3) IC6.J8(X16:J8~CK)
MCK# [diff]: IC2.F1(_3T:F1~IO_L46N_M3CLKN_3) IC6.K8(X16:K8~CK#)
MCODT [ddr]: IC2.M3(_3T:M3~IO_L45N_M3ODT_3) IC6.K9(X16:K9~ODT) R12.1
MCRAS# [ddr]: IC2.N4(_3T:N4~IO_L43P_GCLK23_M3RASN_3) IC6.K7(X16:K7~RAS#)
MCWE# [ddr]: IC2.D2(_3T:D2~IO_L50P_M3WE_3) IC6.K3(X16:K3~WE#)
MLDM [ddr]: IC2.H1(_3B:H1~IO_L42N_GCLK24_M3LDM_3) IC6.F3(X16:F3~LDM)
MLDQ0 [ddr]: IC2.M1(_3B:M1~IO_L38N_M3DQ3_3) IC6.G8(X16:G8~DQ0)
MLDQ1 [ddr]: IC2.M2(_3B:M2~IO_L38P_M3DQ2_3) IC6.G2(X16:G2~DQ1)
MLDQ2 [ddr]: IC2.J1(_3B:J1~IO_L41N_GCLK26_M3DQ5_3) IC6.H7(X16:H7~DQ2)
MLDQ3 [ddr]: IC2.K2(_3B:K2~IO_L40P_M3DQ6_3) IC6.H3(X16:H3~DQ3)
MLDQ4 [ddr]: IC2.J3(_3B:J3~IO_L41P_GCLK27_M3DQ4_3) IC6.H1(X16:H1~DQ4)
MLDQ5 [ddr]: IC2.K1(_3B:K1~IO_L40N_M3DQ7_3) IC6.H9(X16:H9~DQ5)
MLDQ6 [ddr]: IC2.N3(_3B:N3~IO_L37P_M3DQ0_3) IC6.F1(X16:F1~DQ6)
MLDQ7 [ddr]: IC2.N1(_3B:N1~IO_L37N_M3DQ1_3) IC6.F9(X16:F9~DQ7)
MLDQS [diff]: IC2.L3(_3B:L3~IO_L39P_M3LDQS_3) IC6.F7(X16:F7~LDQS)
MLDQS# [diff]: IC2.L1(_3B:L1~IO_L39N_M3LDQSN_3) IC6.E8(X16:E8~LDQS#)
MUDM [ddr]: IC2.H2(_3B:H2~IO_L42P_GCLK25_TRDY2_M3UDM_3) IC6.B3(X16:B3~UDM)
MUDQ8 [ddr]: IC2.U1(_3B:U1~IO_L33N_M3DQ13_3) IC6.C8(X16:C8~DQ8)
MUDQ9 [ddr]: IC2.U3(_3B:U3~IO_L33P_M3DQ12_3) IC6.C2(X16:C2~DQ9)
MUDQ10 [ddr]: IC2.P1(_3B:P1~IO_L36N_M3DQ9_3) IC6.D7(X16:D7~DQ10)
MUDQ11 [ddr]: IC2.R3(_3B:R3~IO_L35P_M3DQ10_3) IC6.D3(X16:D3~DQ11)
MUDQ12 [ddr]: IC2.P2(_3B:P2~IO_L36P_M3DQ8_3) IC6.D1(X16:D1~DQ12)
MUDQ13 [ddr]: IC2.R1(_3B:R1~IO_L35N_M3DQ11_3) IC6.D9(X16:D9~DQ13)
MUDQ14 [ddr]: IC2.V2(_3B:V2~IO_L32P_M3DQ14_3) IC6.B1(X16:B1~DQ14)
MUDQ15 [ddr]: IC2.V1(_3B:V1~IO_L32N_M3DQ15_3) IC6.B9(X16:B9~DQ15)
MUDQS [diff]: IC2.T2(_3B:T2~IO_L34P_M3UDQS_3) IC6.B7(X16:B7~UDQS)
MUDQS# [diff]: IC2.T1(_3B:T1~IO_L34N_M3UDQSN_3) IC6.A8(X16:A8~UDQS#)
N$2 [ddr]: IC2.AA2(_3B:AA2~IO_L1P_3) R16.1
VREF_1.8 [vref]: IC2.A2(_3T:A2~IO_L83N_VREF_3) IC2.AB2(_3B:AB2~IO_L1N_VREF_3) IC2.H5(_3T:H5~IO_L57N_VREF_3) IC2.L6(_3B:L6~IO_L31N_VREF_3) ; also sheet 8

## Sheet 6 of 8
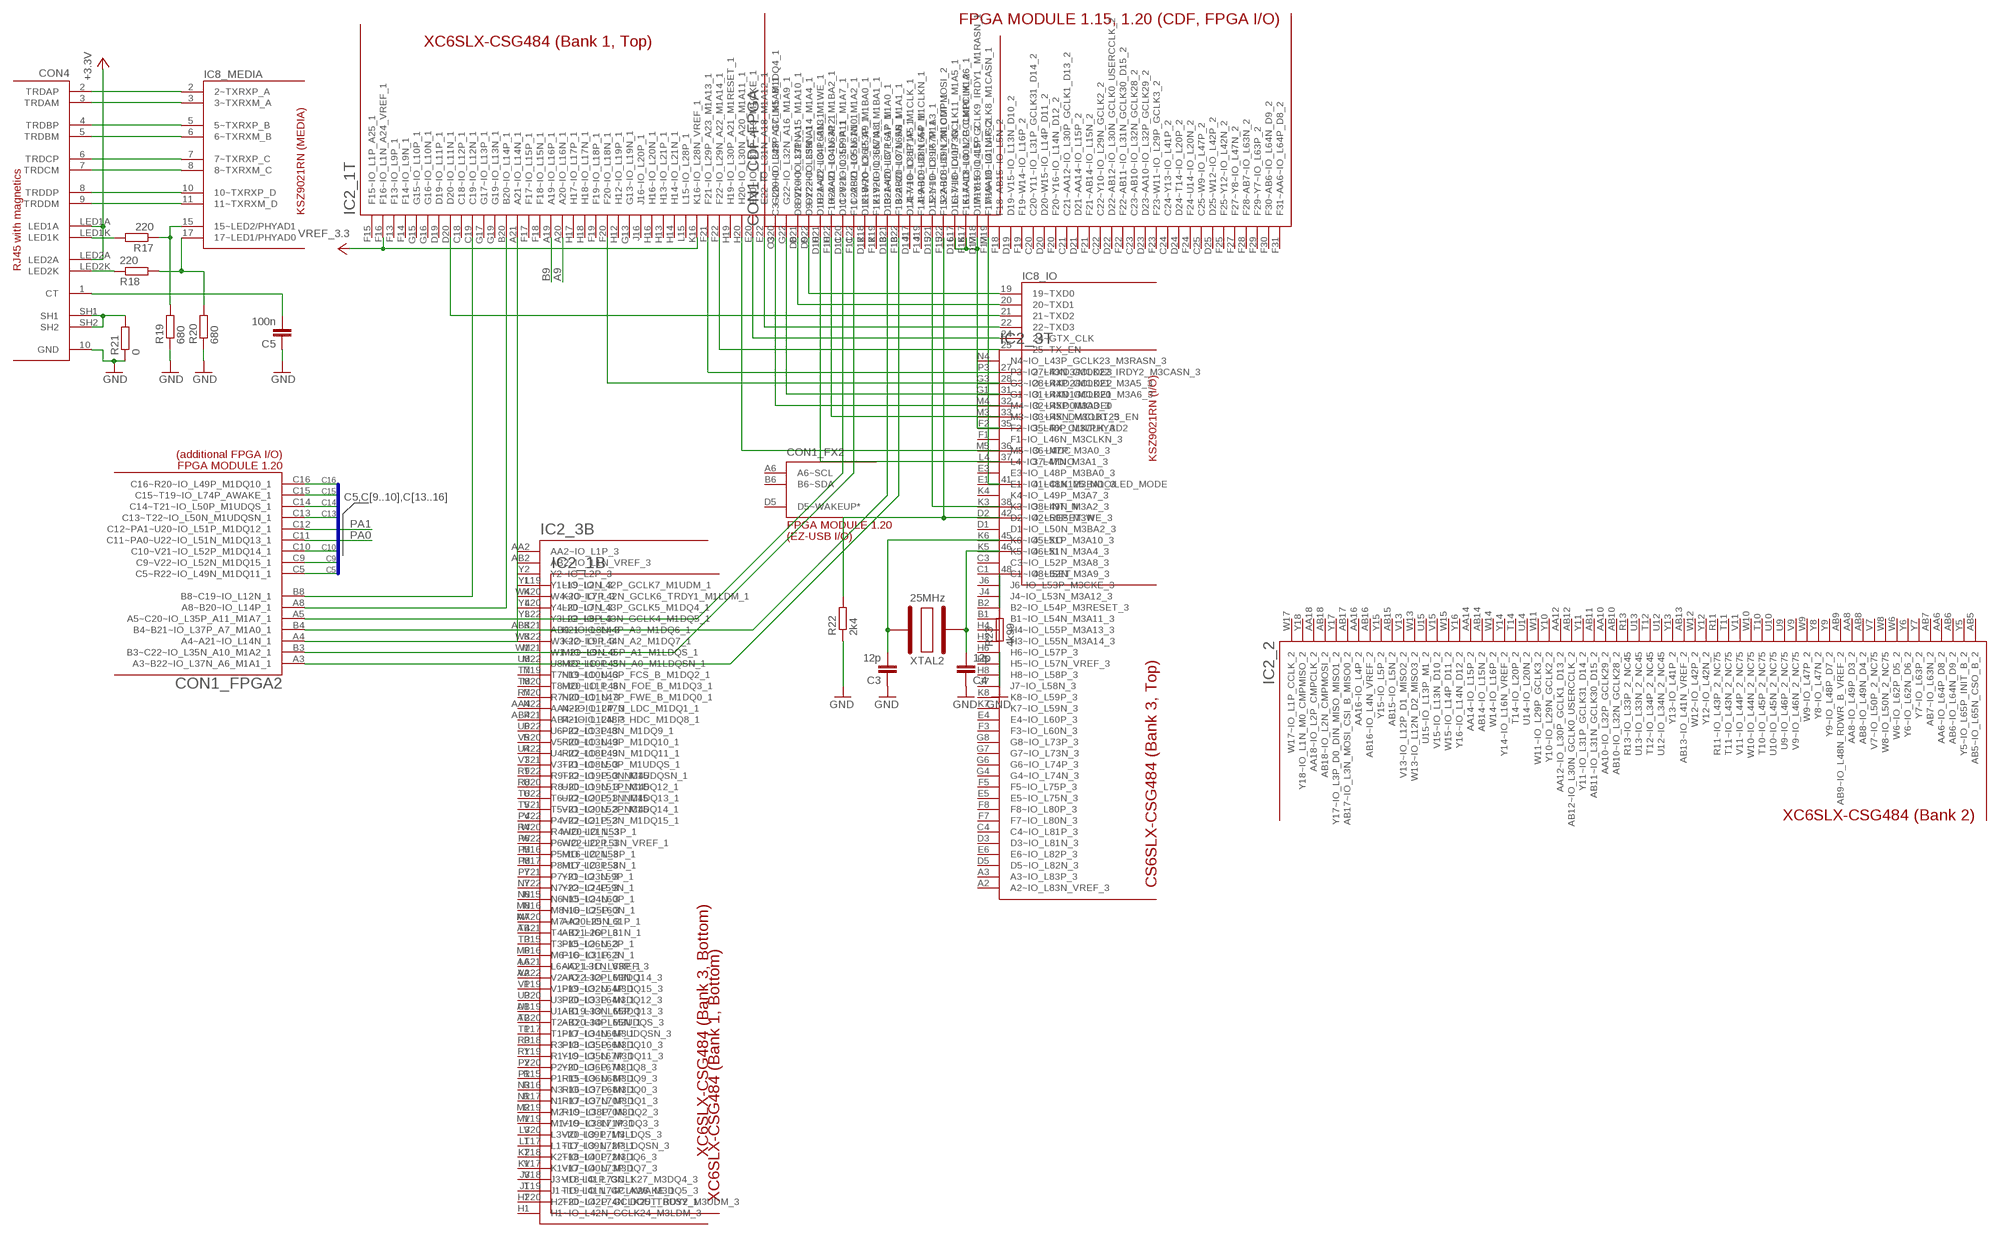
[diagram p5: schematic, sheet 6]

### Parts
C3  12p  C-EUC0805K  [C0805K]
C4  12p  C-EUC0805K  [C0805K]
C5  100n  C-EUC0805K  [C0805K]
CON4  RJ45MAG  [RJ45-MAG]
IC8  KSZ9021RN  [QFN48]
R17  220  R-EU_R0805K  [R0805K]
R18  220  R-EU_R0805K  [R0805K]
R19  680  R-EU_R0805K  [R0805K]
R20  680  R-EU_R0805K  [R0805K]
R21  0  R-EU_R0805K  [R0805K]
R22  2k4  R-EU_R0805K  [R0805K]
R23  4k99  R-EU_R0805K  [R0805K]
XTAL2  25MHz  CRYSTALHU29  [CRYSTAL-HU29]

### Nets
+3.3V [xpwr]: CON4.LED1A CON4.LED2A ; also sheet 1,2,8
A3: CON1.A3(_FPGA2:A3~B22~IO_L37N_A6_M1A1_1) IC2.B22(_1T:B22~IO_L37N_A6_M1A1_1)
A4: CON1.A4(_FPGA2:A4~A21~IO_L14N_1) IC2.A21(_1T:A21~IO_L14N_1)
A5: CON1.A5(_FPGA2:A5~C20~IO_L35P_A11_M1A7_1) IC2.C20(_1T:C20~IO_L35P_A11_M1A7_1)
A8: CON1.A8(_FPGA2:A8~B20~IO_L14P_1) IC2.B20(_1T:B20~IO_L14P_1)
A9: IC2.A20(_1T:A20~IO_L16N_1) ; also sheet 4
B3: CON1.B3(_FPGA2:B3~C22~IO_L35N_A10_M1A2_1) IC2.C22(_1T:C22~IO_L35N_A10_M1A2_1)
B4: CON1.B4(_FPGA2:B4~B21~IO_L37P_A7_M1A0_1) IC2.B21(_1T:B21~IO_L37P_A7_M1A0_1)
B8: CON1.B8(_FPGA2:B8~C19~IO_L12N_1) IC2.C19(_1T:C19~IO_L12N_1)
B9: IC2.A19(_1T:A19~IO_L16P_1) ; also sheet 4
C5: CON1.C5(_FPGA2:C5~R22~IO_L49N_M1DQ11_1) ; also sheet 3
C9: CON1.C9(_FPGA2:C9~V22~IO_L52N_M1DQ15_1) ; also sheet 3
C10: CON1.C10(_FPGA2:C10~V21~IO_L52P_M1DQ14_1) ; also sheet 3
C13: CON1.C13(_FPGA2:C13~T22~IO_L50N_M1UDQSN_1) ; also sheet 3
C14: CON1.C14(_FPGA2:C14~T21~IO_L50P_M1UDQS_1) ; also sheet 3
C15: CON1.C15(_FPGA2:C15~T19~IO_L74P_AWAKE_1) ; also sheet 3
C16: CON1.C16(_FPGA2:C16~R20~IO_L49P_M1DQ10_1) ; also sheet 3
DRDDP: CON4.8(TRDDP) IC8.10(_MEDIA:10~TXRXP_D)
GND [xpwr]: C3.1 C4.1 C5.1 CON4.10(GND) R19.1 R20.1 R21.1 R22.1 R23.1 ; also sheet 1,2,5,8
N$15: IC8.15(_MEDIA:15~LED2/PHYAD1) R17.1 R19.2
N$16: IC8.17(_MEDIA:17~LED1/PHYAD0) R18.2 R20.2
N$17: CON4.LED2K R18.1
N$18: CON4.LED1K R17.2
N$19: C5.2 CON4.1(CT)
N$20: CON4.SH1 CON4.SH2 R21.2
N$21: IC2.J22(_1T:J22~IO_L39N_M1ODT_1) IC8.42(_IO:42~RESET_N) R22.2
N$23: IC8.48(_IO:48~ISET) R23.2
N$36: IC2.H20(_1T:H20~IO_L30N_A20_M1A11_1) IC8.36(_IO:36~MDC)
N$37: IC2.H21(_1T:H21~IO_L34P_A13_M1WE_1) IC8.37(_IO:37~MDIO)
N$38: IC2.M19(_1T:M19~IO_L41N_GCLK8_M1CASN_1) IC8.41(_IO:41~CLK125_NDO/LED_MODE)
N$39: IC2.J21(_1T:J21~IO_L39P_M1A3_1) IC8.38(_IO:38~INT_N)
PA0: CON1.C11(_FPGA2:C11~PA0~U22~IO_L51N_M1DQ13_1) ; also sheet 1,3
PA1: CON1.C12(_FPGA2:C12~PA1~U20~IO_L51P_M1DQ12_1) ; also sheet 1,3
RXCLK: IC2.K17(_1T:K17~IO_L40N_GCLK10_M1A6_1) IC2.L17(_1T:L17~IO_L40P_GCLK11_M1A5_1) IC2.M18(_1T:M18~IO_L41P_GCLK9_IRDY1_M1RASN_1) IC8.35(_IO:35~RX_CLK/PHYAD2)
RXD0: IC2.G20(_1T:G20~IO_L32P_A17_M1A8_1) IC8.32(_IO:32~RXD0/MODE0)
RXD1: IC2.G22(_1T:G22~IO_L32N_A16_M1A9_1) IC8.31(_IO:31~RXD1/MODE1)
RXD2: IC2.F20(_1T:F20~IO_L18N_1) IC8.28(_IO:28~RXD2/MODE2)
RXD3: IC2.F21(_1T:F21~IO_L29P_A23_M1A13_1) IC8.27(_IO:27~RXD3/MODE3)
RXDV: IC2.H22(_1T:H22~IO_L34N_A12_M1BA2_1) IC8.33(_IO:33~RX_DV/CLK125_EN)
TRDAM: CON4.3(TRDAM) IC8.3(_MEDIA:3~TXRXM_A)
TRDAP: CON4.2(TRDAP) IC8.2(_MEDIA:2~TXRXP_A)
TRDBM: CON4.5(TRDBM) IC8.6(_MEDIA:6~TXRXM_B)
TRDBP: CON4.4(TRDBP) IC8.5(_MEDIA:5~TXRXP_B)
TRDCM: CON4.7(TRDCM) IC8.8(_MEDIA:8~TXRXM_C)
TRDCP: CON4.6(TRDCP) IC8.7(_MEDIA:7~TXRXP_C)
TRDDM: CON4.9(TRDDM) IC8.11(_MEDIA:11~TXRXM_D)
TXCLK: IC2.E20(_1T:E20~IO_L31P_A19_M1CKE_1) IC8.24(_IO:24~GTX_CLK)
TXD0: IC2.D22(_1T:D22~IO_L33N_A14_M1A4_1) IC8.19(_IO:19~TXD0)
TXD1: IC2.D21(_1T:D21~IO_L33P_A15_M1A10_1) IC8.20(_IO:20~TXD1)
TXD2: IC2.D20(_1T:D20~IO_L11N_1) IC8.21(_IO:21~TXD2)
TXD3: IC2.E22(_1T:E22~IO_L31N_A18_M1A12_1) IC8.22(_IO:22~TXD3)
TXEN: IC2.F22(_1T:F22~IO_L29N_A22_M1A14_1) IC8.25(_IO:25~TX_EN)
VREF_3.3 [vref]: IC2.F16(_1T:F16~IO_L1N_A24_VREF_1) IC2.K16(_1T:K16~IO_L28N_VREF_1) ; also sheet 3,8
XTAL1A1: C4.2 IC8.46(_IO:46~XI) XTAL2.P$2
XTAL1B1: C3.2 IC8.45(_IO:45~XO) XTAL2.P$1
Unconnected: IC2.C18(_1T:C18~IO_L12P_1) IC2.D19(_1T:D19~IO_L11P_1) IC2.F13(_1T:F13~IO_L9P_1) IC2.F14(_1T:F14~IO_L9N_1) IC2.F15(_1T:F15~IO_L1P_A25_1) IC2.F17(_1T:F17~IO_L15P_1) IC2.F18(_1T:F18~IO_L15N_1) IC2.F19(_1T:F19~IO_L18P_1) IC2.G13(_1T:G13~IO_L19N_1) IC2.G15(_1T:G15~IO_L10P_1) IC2.G16(_1T:G16~IO_L10N_1) IC2.G17(_1T:G17~IO_L13P_1) IC2.G19(_1T:G19~IO_L13N_1) IC2.H12(_1T:H12~IO_L19P_1) IC2.H13(_1T:H13~IO_L21P_1) IC2.H14(_1T:H14~IO_L21N_1) IC2.H16(_1T:H16~IO_L20N_1) IC2.H17(_1T:H17~IO_L17P_1) IC2.H18(_1T:H18~IO_L17N_1) IC2.H19(_1T:H19~IO_L30P_A21_M1RESET_1) IC2.J16(_1T:J16~IO_L20P_1) IC2.J17(_1T:J17~IO_L38P_A5_M1CLK_1) IC2.J19(_1T:J19~IO_L38N_A4_M1CLKN_1) IC2.K18(_1T:K18~IO_L36P_A9_M1BA0_1) IC2.K19(_1T:K19~IO_L36N_A8_M1BA1_1) IC2.L15(_1T:L15~IO_L28P_1)

### Buses
C5,C[9..10],C[13..16]

## Sheet 7 of 8

## Sheet 8 of 8
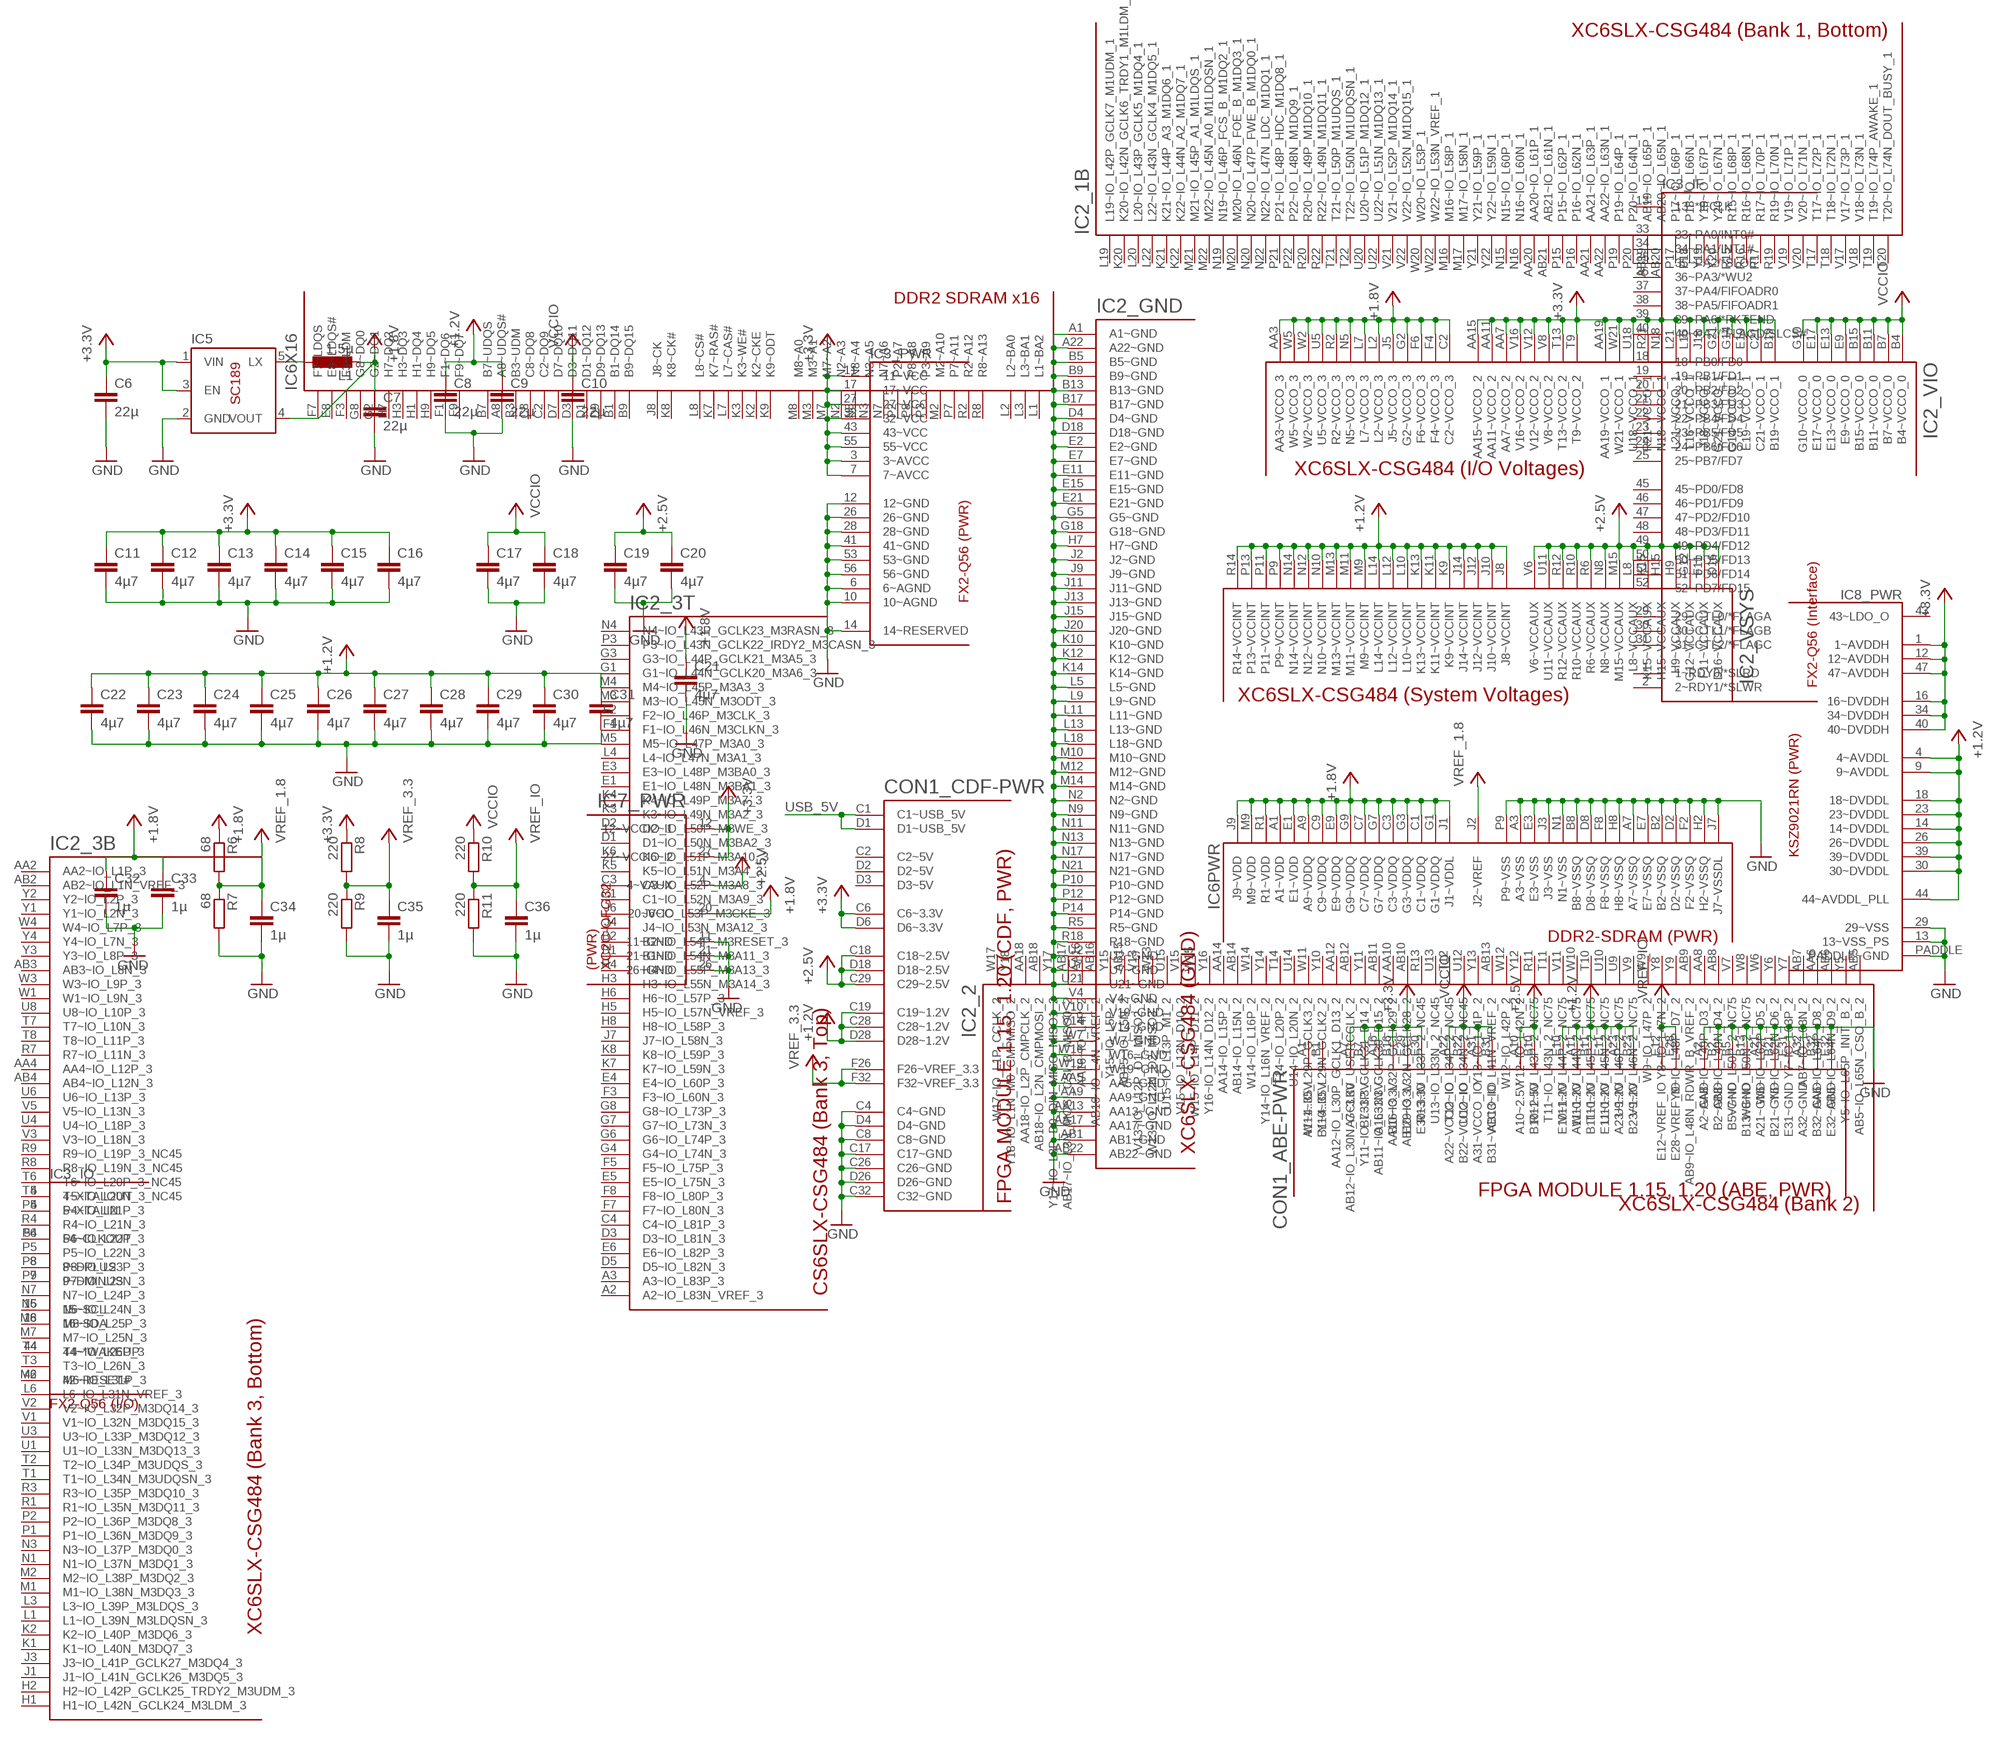
[diagram p6: schematic, sheet 8, part 1 of 2]
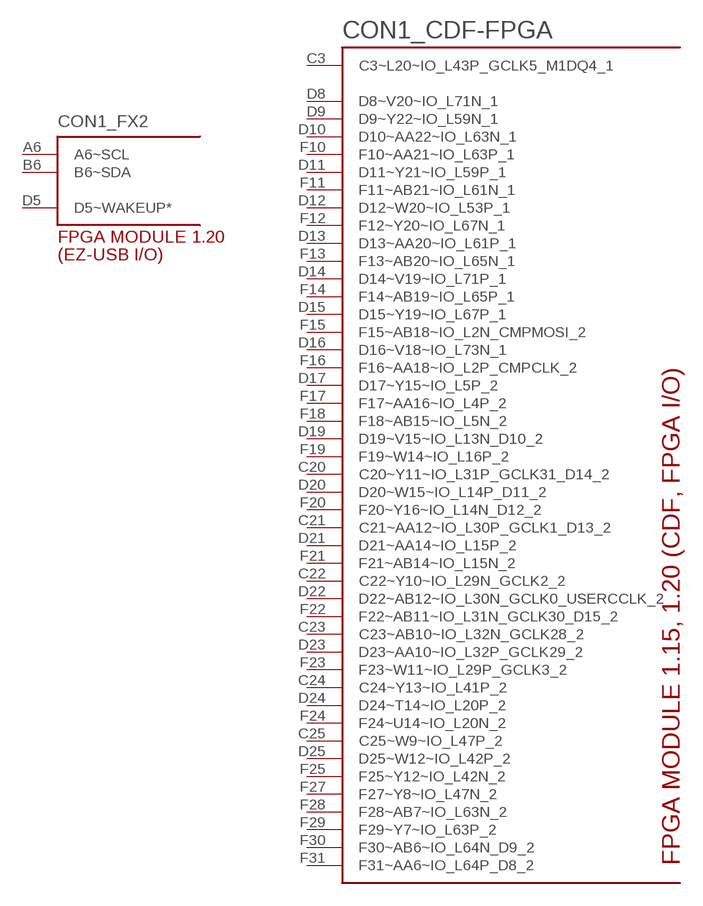
[diagram p7: schematic, sheet 8, part 2 of 2]

### Parts
C6  22µ  C-EUC0805K  [C0805K]
C7  22µ  C-EUC0805K  [C0805K]
C8  22µ  C-EUC0805K  [C0805K]
C9  22µ  C-EUC0805K  [C0805K]
C10  22µ  C-EUC0805K  [C0805K]
C11  4µ7  C-EUC0508K  [0508K]
C12  4µ7  C-EUC0508K  [0508K]
C13  4µ7  C-EUC0508K  [0508K]
C14  4µ7  C-EUC0508K  [0508K]
C15  4µ7  C-EUC0508K  [0508K]
C16  4µ7  C-EUC0508K  [0508K]
C17  4µ7  C-EUC0508K  [0508K]
C18  4µ7  C-EUC0508K  [0508K]
C19  4µ7  C-EUC0508K  [0508K]
C20  4µ7  C-EUC0508K  [0508K]
C21  4µ7  C-EUC0508K  [0508K]
C22  4µ7  C-EUC0508K  [0508K]
C23  4µ7  C-EUC0508K  [0508K]
C24  4µ7  C-EUC0508K  [0508K]
C25  4µ7  C-EUC0508K  [0508K]
C26  4µ7  C-EUC0508K  [0508K]
C27  4µ7  C-EUC0508K  [0508K]
C28  4µ7  C-EUC0508K  [0508K]
C29  4µ7  C-EUC0508K  [0508K]
C30  4µ7  C-EUC0508K  [0508K]
C31  4µ7  C-EUC0508K  [0508K]
C32  1µ  C-EUC0603K  [C0603K]
C33  1µ  C-EUC0603K  [C0603K]
C34  1µ  C-EUC0603K  [C0603K]
C35  1µ  C-EUC0603K  [C0603K]
C36  1µ  C-EUC0603K  [C0603K]
IC5  SC189SOT23-5  [SOT23-5]
L1  1.5µ  L-EUL1008  [L1008]
R6  68  R-EU_R0805K  [R0805K]
R7  68  R-EU_R0805K  [R0805K]
R8  220  R-EU_R0805K  [R0805K]
R9  220  R-EU_R0805K  [R0805K]
R10  220  R-EU_R0805K  [R0805K]
R11  220  R-EU_R0805K  [R0805K]

### Nets
+1.2V [xpwr]: C8.1 C9.1 C22.P$1 C23.P$1 C24.P$1 C25.P$1 C26.P$1 C27.P$1 C28.P$1 C29.P$1 C30.P$1 C31.P$1 CON1.A11(_ABE-PWR:A11~1.2V) CON1.A23(_ABE-PWR:A23~1.2V) CON1.B11(_ABE-PWR:B11~1.2V) CON1.B23(_ABE-PWR:B23~1.2V) CON1.C19(_CDF-PWR:C19~1.2V) CON1.C28(_CDF-PWR:C28~1.2V) CON1.D28(_CDF-PWR:D28~1.2V) CON1.E10(_ABE-PWR:E10~1.2V) CON1.E11(_ABE-PWR:E11~1.2V) IC2.J8(_VSYS:J8~VCCINT) IC2.J10(_VSYS:J10~VCCINT) IC2.J12(_VSYS:J12~VCCINT) IC2.J14(_VSYS:J14~VCCINT) IC2.K9(_VSYS:K9~VCCINT) IC2.K11(_VSYS:K11~VCCINT) IC2.K13(_VSYS:K13~VCCINT) IC2.L10(_VSYS:L10~VCCINT) IC2.L12(_VSYS:L12~VCCINT) IC2.L14(_VSYS:L14~VCCINT) IC2.M9(_VSYS:M9~VCCINT) IC2.M11(_VSYS:M11~VCCINT) IC2.M13(_VSYS:M13~VCCINT) IC2.N10(_VSYS:N10~VCCINT) IC2.N12(_VSYS:N12~VCCINT) IC2.N14(_VSYS:N14~VCCINT) IC2.P9(_VSYS:P9~VCCINT) IC2.P11(_VSYS:P11~VCCINT) IC2.P13(_VSYS:P13~VCCINT) IC2.R14(_VSYS:R14~VCCINT) IC8.4(_PWR:4~AVDDL) IC8.9(_PWR:9~AVDDL) IC8.14(_PWR:14~DVDDL) IC8.18(_PWR:18~DVDDL) IC8.23(_PWR:23~DVDDL) IC8.26(_PWR:26~DVDDL) IC8.30(_PWR:30~DVDDL) IC8.39(_PWR:39~DVDDL) IC8.44(_PWR:44~AVDDL_PLL)
+1.8V [pwr]: C7.1 C21.P$1 C32.1 C33.1 IC2.AA3(_VIO:AA3~VCCO_3) IC2.C2(_VIO:C2~VCCO_3) IC2.F4(_VIO:F4~VCCO_3) IC2.F6(_VIO:F6~VCCO_3) IC2.G2(_VIO:G2~VCCO_3) IC2.J5(_VIO:J5~VCCO_3) IC2.L2(_VIO:L2~VCCO_3) IC2.L7(_VIO:L7~VCCO_3) IC2.N5(_VIO:N5~VCCO_3) IC2.R2(_VIO:R2~VCCO_3) IC2.U5(_VIO:U5~VCCO_3) IC2.W2(_VIO:W2~VCCO_3) IC2.W5(_VIO:W5~VCCO_3) IC5.4(VOUT) IC6.A1(PWR:A1~VDD) IC6.A9(PWR:A9~VDDQ) IC6.C1(PWR:C1~VDDQ) IC6.C3(PWR:C3~VDDQ) IC6.C7(PWR:C7~VDDQ) IC6.C9(PWR:C9~VDDQ) IC6.E1(PWR:E1~VDD) IC6.E9(PWR:E9~VDDQ) IC6.G1(PWR:G1~VDDQ) IC6.G3(PWR:G3~VDDQ) IC6.G7(PWR:G7~VDDQ) IC6.G9(PWR:G9~VDDQ) IC6.J1(PWR:J1~VDDL) IC6.J9(PWR:J9~VDD) IC6.M9(PWR:M9~VDD) IC6.R1(PWR:R1~VDD) IC7.20(_PWR:20~VCC) L1.P$2 R6.1
+2.5V [spwr]: C19.P$1 C20.P$1 CON1.A10(_ABE-PWR:A10~2.5V) CON1.B10(_ABE-PWR:B10~2.5V) CON1.C18(_CDF-PWR:C18~2.5V) CON1.C29(_CDF-PWR:C29~2.5V) CON1.D18(_CDF-PWR:D18~2.5V) IC2.D16(_VSYS:D16~VCCAUX) IC2.F11(_VSYS:F11~VCCAUX) IC2.G12(_VSYS:G12~VCCAUX) IC2.H9(_VSYS:H9~VCCAUX) IC2.H15(_VSYS:H15~VCCAUX) IC2.K15(_VSYS:K15~VCCAUX) IC2.L8(_VSYS:L8~VCCAUX) IC2.M15(_VSYS:M15~VCCAUX) IC2.N8(_VSYS:N8~VCCAUX) IC2.R6(_VSYS:R6~VCCAUX) IC2.R10(_VSYS:R10~VCCAUX) IC2.R12(_VSYS:R12~VCCAUX) IC2.U11(_VSYS:U11~VCCAUX) IC2.V6(_VSYS:V6~VCCAUX) IC7.4(_PWR:4~VAUX)
+3.3V [xpwr]: C6.1 C11.P$1 C12.P$1 C13.P$1 C14.P$1 C15.P$1 C16.P$1 CON1.A7(_ABE-PWR:A7~3.3V) CON1.A16(_ABE-PWR:A16~3.3V) CON1.B7(_ABE-PWR:B7~3.3V) CON1.B16(_ABE-PWR:B16~3.3V) CON1.C6(_CDF-PWR:C6~3.3V) CON1.D6(_CDF-PWR:D6~3.3V) CON1.E29(_ABE-PWR:E29~3.3V) CON1.E30(_ABE-PWR:E30~3.3V) IC2.AA7(_VIO:AA7~VCCO_2) IC2.AA11(_VIO:AA11~VCCO_2) IC2.AA15(_VIO:AA15~VCCO_2) IC2.AA19(_VIO:AA19~VCCO_1) IC2.B19(_VIO:B19~VCCO_1) IC2.C21(_VIO:C21~VCCO_1) IC2.E19(_VIO:E19~VCCO_1) IC2.G14(_VIO:G14~VCCO_1) IC2.G21(_VIO:G21~VCCO_1) IC2.J18(_VIO:J18~VCCO_1) IC2.L16(_VIO:L16~VCCO_1) IC2.L21(_VIO:L21~VCCO_1) IC2.N18(_VIO:N18~VCCO_1) IC2.R21(_VIO:R21~VCCO_1) IC2.T9(_VIO:T9~VCCO_2) IC2.T13(_VIO:T13~VCCO_2) IC2.U18(_VIO:U18~VCCO_1) IC2.V8(_VIO:V8~VCCO_2) IC2.V12(_VIO:V12~VCCO_2) IC2.V16(_VIO:V16~VCCO_2) IC2.W21(_VIO:W21~VCCO_1) IC3.3(_PWR:3~AVCC) IC3.7(_PWR:7~AVCC) IC3.11(_PWR:11~VCC) IC3.17(_PWR:17~VCC) IC3.27(_PWR:27~VCC) IC3.32(_PWR:32~VCC) IC3.43(_PWR:43~VCC) IC3.55(_PWR:55~VCC) IC5.1(VIN) IC5.3(EN) IC7.12(_PWR:12~VCCIO_1) IC7.27(_PWR:27~VCCIO_2) IC8.1(_PWR:1~AVDDH) IC8.12(_PWR:12~AVDDH) IC8.16(_PWR:16~DVDDH) IC8.34(_PWR:34~DVDDH) IC8.40(_PWR:40~DVDDH) IC8.47(_PWR:47~AVDDH) R8.1 ; also sheet 1,2,6
GND [xpwr]: C6.2 C7.2 C8.2 C9.2 C10.2 C11.P$2 C12.P$2 C13.P$2 C14.P$2 C15.P$2 C16.P$2 C17.P$2 C18.P$2 C19.P$2 C20.P$2 C21.P$2 C22.P$2 C23.P$2 C24.P$2 C25.P$2 C26.P$2 C27.P$2 C28.P$2 C29.P$2 C30.P$2 C31.P$2 C32.2 C33.2 C34.2 C35.2 C36.2 CON1.A2(_ABE-PWR:A2~GND) CON1.A21(_ABE-PWR:A21~GND) CON1.A32(_ABE-PWR:A32~GND) CON1.B2(_ABE-PWR:B2~GND) CON1.B5(_ABE-PWR:B5~GND) CON1.B13(_ABE-PWR:B13~GND) CON1.B21(_ABE-PWR:B21~GND) CON1.B32(_ABE-PWR:B32~GND) CON1.C4(_CDF-PWR:C4~GND) CON1.C8(_CDF-PWR:C8~GND) CON1.C17(_CDF-PWR:C17~GND) CON1.C26(_CDF-PWR:C26~GND) CON1.C32(_CDF-PWR:C32~GND) CON1.D4(_CDF-PWR:D4~GND) CON1.D26(_CDF-PWR:D26~GND) CON1.E31(_ABE-PWR:E31~GND) CON1.E32(_ABE-PWR:E32~GND) IC2.A1(_GND:A1~GND) IC2.A22(_GND:A22~GND) IC2.AA5(_GND:AA5~GND) IC2.AA9(_GND:AA9~GND) IC2.AA13(_GND:AA13~GND) IC2.AA17(_GND:AA17~GND) IC2.AB1(_GND:AB1~GND) IC2.AB22(_GND:AB22~GND) IC2.B5(_GND:B5~GND) IC2.B9(_GND:B9~GND) IC2.B13(_GND:B13~GND) IC2.B17(_GND:B17~GND) IC2.D4(_GND:D4~GND) IC2.D18(_GND:D18~GND) IC2.E2(_GND:E2~GND) IC2.E7(_GND:E7~GND) IC2.E11(_GND:E11~GND) IC2.E15(_GND:E15~GND) IC2.E21(_GND:E21~GND) IC2.G5(_GND:G5~GND) IC2.G18(_GND:G18~GND) IC2.H7(_GND:H7~GND) IC2.J2(_GND:J2~GND) IC2.J9(_GND:J9~GND) IC2.J11(_GND:J11~GND) IC2.J13(_GND:J13~GND) IC2.J15(_GND:J15~GND) IC2.J20(_GND:J20~GND) IC2.K10(_GND:K10~GND) IC2.K12(_GND:K12~GND) IC2.K14(_GND:K14~GND) IC2.L5(_GND:L5~GND) IC2.L9(_GND:L9~GND) IC2.L11(_GND:L11~GND) IC2.L13(_GND:L13~GND) IC2.L18(_GND:L18~GND) IC2.M10(_GND:M10~GND) IC2.M12(_GND:M12~GND) IC2.M14(_GND:M14~GND) IC2.N2(_GND:N2~GND) IC2.N9(_GND:N9~GND) IC2.N11(_GND:N11~GND) IC2.N13(_GND:N13~GND) IC2.N17(_GND:N17~GND) IC2.N21(_GND:N21~GND) IC2.P10(_GND:P10~GND) IC2.P12(_GND:P12~GND) IC2.P14(_GND:P14~GND) IC2.R5(_GND:R5~GND) IC2.R18(_GND:R18~GND) IC2.U2(_GND:U2~GND) IC2.U7(_GND:U7~GND) IC2.U21(_GND:U21~GND) IC2.V4(_GND:V4~GND) IC2.V10(_GND:V10~GND) IC2.V14(_GND:V14~GND) IC2.W7(_GND:W7~GND) IC2.W16(_GND:W16~GND) IC2.W19(_GND:W19~GND) IC3.6(_PWR:6~AGND) IC3.10(_PWR:10~AGND) IC3.12(_PWR:12~GND) IC3.14(_PWR:14~RESERVED) IC3.26(_PWR:26~GND) IC3.28(_PWR:28~GND) IC3.41(_PWR:41~GND) IC3.53(_PWR:53~GND) IC3.56(_PWR:56~GND) IC5.2(GND) IC6.A3(PWR:A3~VSS) IC6.A7(PWR:A7~VSSQ) IC6.B2(PWR:B2~VSSQ) IC6.B8(PWR:B8~VSSQ) IC6.D2(PWR:D2~VSSQ) IC6.D8(PWR:D8~VSSQ) IC6.E3(PWR:E3~VSS) IC6.E7(PWR:E7~VSSQ) IC6.F2(PWR:F2~VSSQ) IC6.F8(PWR:F8~VSSQ) IC6.H2(PWR:H2~VSSQ) IC6.H8(PWR:H8~VSSQ) IC6.J3(PWR:J3~VSS) IC6.J7(PWR:J7~VSSDL) IC6.N1(PWR:N1~VSS) IC6.P9(PWR:P9~VSS) IC7.11(_PWR:11~GND) IC7.21(_PWR:21~GND) IC7.26(_PWR:26~GND) IC8.13(_PWR:13~VSS_PS) IC8.29(_PWR:29~VSS) IC8.PADDLE(_PWR:PADDLE~GND) R7.2 R9.2 R11.2 ; also sheet 1,2,5,6
LX: IC5.5(LX) L1.P$1
USB_5V [pwr]: CON1.C1(_CDF-PWR:C1~USB_5V) CON1.D1(_CDF-PWR:D1~USB_5V) ; also sheet 1
VCCIO [pwr]: C10.1 C17.P$1 C18.P$1 CON1.A22(_ABE-PWR:A22~VCCO_IO) CON1.A31(_ABE-PWR:A31~VCCO_IO) CON1.B22(_ABE-PWR:B22~VCCO_IO) CON1.B31(_ABE-PWR:B31~VCCO_IO) IC2.B4(_VIO:B4~VCCO_0) IC2.B7(_VIO:B7~VCCO_0) IC2.B11(_VIO:B11~VCCO_0) IC2.B15(_VIO:B15~VCCO_0) IC2.E9(_VIO:E9~VCCO_0) IC2.E13(_VIO:E13~VCCO_0) IC2.E17(_VIO:E17~VCCO_0) IC2.G10(_VIO:G10~VCCO_0) R10.1
VREF_1.8 [vref]: C34.1 IC6.J2(PWR:J2~VREF) R6.2 R7.1 ; also sheet 5
VREF_3.3 [vref]: C35.1 CON1.F26(_CDF-PWR:F26~VREF_3.3) CON1.F32(_CDF-PWR:F32~VREF_3.3) R8.2 R9.1 ; also sheet 3,6
VREF_IO [vref]: C36.1 CON1.E12(_ABE-PWR:E12~VREF_IO) CON1.E28(_ABE-PWR:E28~VREF_IO) R10.2 R11.1 ; also sheet 4
Unconnected: CON1.A1(_ABE-PWR:A1~4..35V) CON1.B1(_ABE-PWR:B1~4..35V) CON1.C2(_CDF-PWR:C2~5V) CON1.D2(_CDF-PWR:D2~5V) CON1.D3(_CDF-PWR:D3~5V) IC2.A3(_3T:A3~IO_L83P_3) IC2.AA4(_3B:AA4~IO_L12P_3) IC2.AB3(_3B:AB3~IO_L8N_3) IC2.AB4(_3B:AB4~IO_L12N_3) IC2.B2(_3T:B2~IO_L54P_M3RESET_3) IC2.C4(_3T:C4~IO_L81P_3) IC2.D3(_3T:D3~IO_L81N_3) IC2.D5(_3T:D5~IO_L82N_3) IC2.E4(_3T:E4~IO_L60P_3) IC2.E5(_3T:E5~IO_L75N_3) IC2.E6(_3T:E6~IO_L82P_3) IC2.F3(_3T:F3~IO_L60N_3) IC2.F5(_3T:F5~IO_L75P_3) IC2.F7(_3T:F7~IO_L80N_3) IC2.F8(_3T:F8~IO_L80P_3) IC2.G4(_3T:G4~IO_L74N_3) IC2.G6(_3T:G6~IO_L74P_3) IC2.G7(_3T:G7~IO_L73N_3) IC2.G8(_3T:G8~IO_L73P_3) IC2.H3(_3T:H3~IO_L55N_M3A14_3) IC2.H6(_3T:H6~IO_L57P_3) IC2.H8(_3T:H8~IO_L58P_3) IC2.J7(_3T:J7~IO_L58N_3) IC2.K7(_3T:K7~IO_L59N_3) IC2.K8(_3T:K8~IO_L59P_3) IC2.L19(_1B:L19~IO_L42P_GCLK7_M1UDM_1) IC2.M6(_3B:M6~IO_L31P_3) IC2.M7(_3B:M7~IO_L25N_3) IC2.M8(_3B:M8~IO_L25P_3) IC2.M16(_1B:M16~IO_L58P_1) IC2.M17(_1B:M17~IO_L58N_1) IC2.M20(_1B:M20~IO_L46N_FOE_B_M1DQ3_1) IC2.N6(_3B:N6~IO_L24N_3) IC2.N7(_3B:N7~IO_L24P_3) IC2.N15(_1B:N15~IO_L60P_1) IC2.N16(_1B:N16~IO_L60N_1) IC2.P4(_3B:P4~IO_L21P_3) IC2.P5(_3B:P5~IO_L22N_3) IC2.P6(_3B:P6~IO_L22P_3) IC2.P7(_3B:P7~IO_L23N_3) IC2.P8(_3B:P8~IO_L23P_3) IC2.P15(_1B:P15~IO_L62P_1) IC2.P16(_1B:P16~IO_L62N_1) IC2.P17(_1B:P17~IO_L66P_1) IC2.P18(_1B:P18~IO_L66N_1) IC2.P19(_1B:P19~IO_L64P_1) IC2.R4(_3B:R4~IO_L21N_3) IC2.R7(_3B:R7~IO_L11N_3) IC2.R8(_3B:R8~IO_L19N_3_NC45) IC2.R9(_3B:R9~IO_L19P_3_NC45) IC2.R11(_2:R11~IO_L43P_2_NC75) IC2.R13(_2:R13~IO_L33P_2_NC45) IC2.R15(_1B:R15~IO_L68P_1) IC2.R16(_1B:R16~IO_L68N_1) IC2.R17(_1B:R17~IO_L70P_1) IC2.T3(_3B:T3~IO_L26N_3) IC2.T4(_3B:T4~IO_L26P_3) IC2.T5(_3B:T5~IO_L20N_3_NC45) IC2.T6(_3B:T6~IO_L20P_3_NC45) IC2.T7(_3B:T7~IO_L10N_3) IC2.T8(_3B:T8~IO_L11P_3) IC2.T10(_2:T10~IO_L45P_2_NC75) IC2.T11(_2:T11~IO_L43N_2_NC75) IC2.T12(_2:T12~IO_L34P_2_NC45) IC2.T17(_1B:T17~IO_L72P_1) IC2.T20(_1B:T20~IO_L74N_DOUT_BUSY_1) IC2.U4(_3B:U4~IO_L18P_3) IC2.U6(_3B:U6~IO_L13P_3) IC2.U8(_3B:U8~IO_L10P_3) IC2.U9(_2:U9~IO_L46P_2_NC75) IC2.U10(_2:U10~IO_L45N_2_NC75) IC2.U12(_2:U12~IO_L34N_2_NC45) IC2.U13(_2:U13~IO_L33N_2_NC45) IC2.V3(_3B:V3~IO_L18N_3) IC2.V5(_3B:V5~IO_L13N_3) IC2.V7(_2:V7~IO_L50P_2_NC75) IC2.V9(_2:V9~IO_L46N_2_NC75) IC2.V11(_2:V11~IO_L44P_2_NC75) IC2.W1(_3B:W1~IO_L9N_3) IC2.W3(_3B:W3~IO_L9P_3) IC2.W4(_3B:W4~IO_L7P_3) IC2.W8(_2:W8~IO_L50N_2_NC75) IC2.W10(_2:W10~IO_L44N_2_NC75) IC2.Y1(_3B:Y1~IO_L2N_3) IC2.Y2(_3B:Y2~IO_L2P_3) IC2.Y3(_3B:Y3~IO_L8P_3) IC2.Y4(_3B:Y4~IO_L7N_3) IC8.43(_PWR:43~LDO_O)

## Library data of the parts
C1-C5 = rcl:C-EU: CAPACITOR, European symbol
C6-C36 = myrcl:C-EU: CAPACITOR, European symbol
CON1 = usb-fpga-1:1GBE-USB-FPGA1.20
CON2 = mystuff:MICROSD
CON3 = mystuff:USB-THT
CON4 = mystuff:RJ45MAG
IC1 = microchip:CAT24C128
IC2 = xlinix:XC6SLX-CSG484
IC3 = fx2:FX2-Q56
IC4 = mystuff:STM811
IC5 = mystuff:SC189
IC6 = mystuff:DDR2_SDRAM-X16
IC7 = xlinix:XC2C-QFG32
IC8 = mystuff:KSZ9021RN
IC9 = microchip:24AA025E48/OT
JP1 = jumper:JP1E: JUMPER
L1 = rcl:L-EU: INDUCTOR, European symbol
LED1 = mydiode:LED
R1-R3 R6-R16 = rcl:R-EU_: RESISTOR, European symbol
R4 R5 R17-R23 = myrcl:R-EU_: RESISTOR, European symbol
XTAL1 XTAL2 = mystuff:CRYSTAL

## Net classes
0 default: width 0.1 mm
4 ddr: width 0.1 mm
6 diff: width 0.11 mm